# EAGLE design design 1 - fan controller (EAGLE 9.6.2)
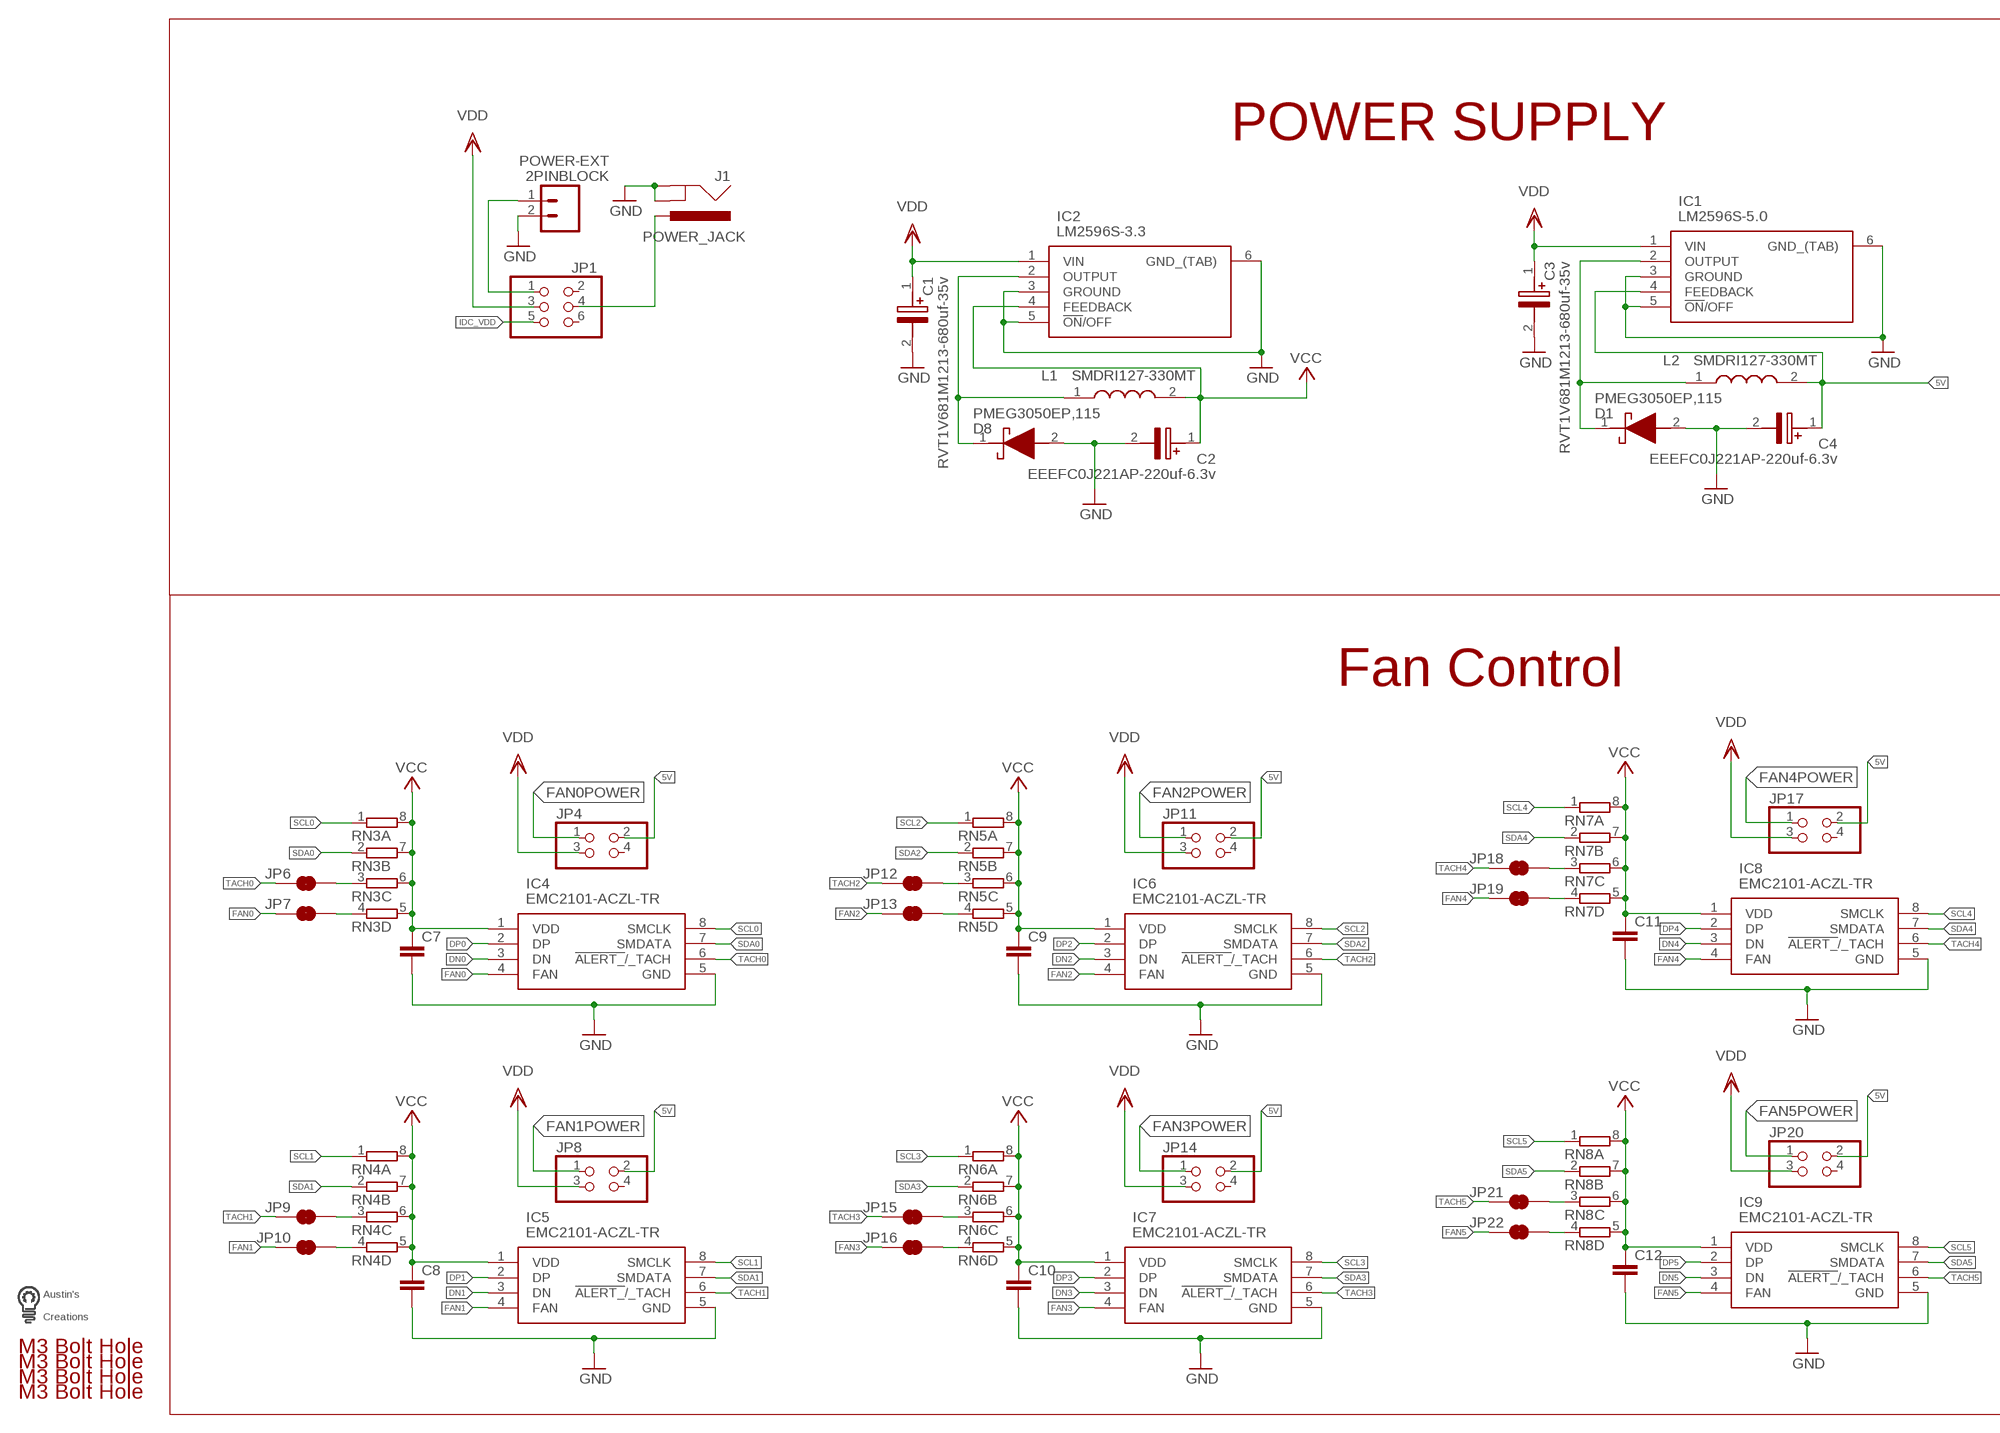
[diagram p0: schematic, sheet 1, part 1 of 2]
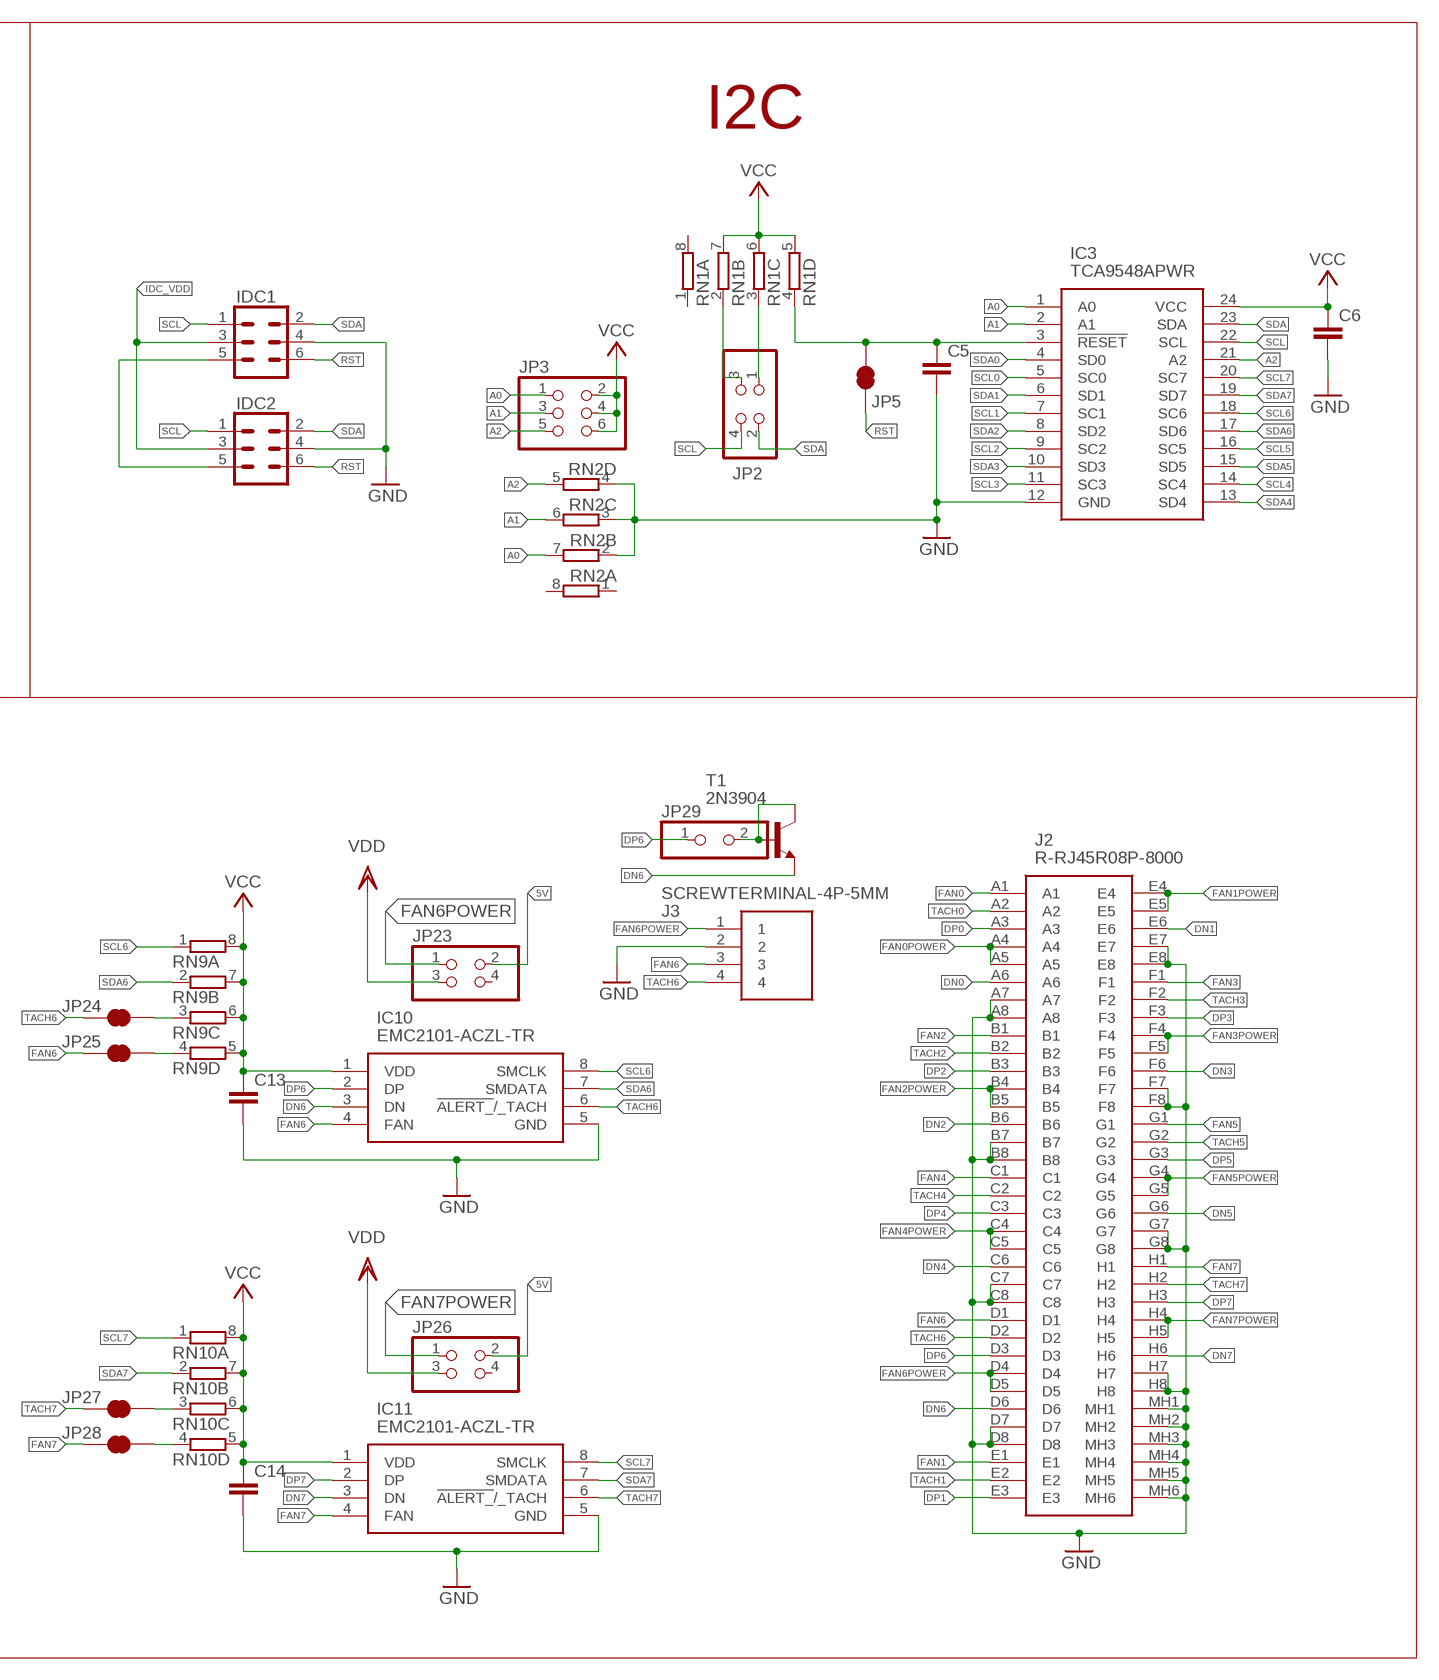
[diagram p1: schematic, sheet 1, part 2 of 2]

## Parts
C1  RVT1V681M1213-680uf-35v  EEE-HD1V681AQ  [CAPAE1350X1400N]
C2  EEEFC0J221AP-220uf-6.3v  EEEFC0J221AP  [CAPAE830X650N]
C3  RVT1V681M1213-680uf-35v  EEE-HD1V681AQ  [CAPAE1350X1400N]
C4  EEEFC0J221AP-220uf-6.3v  EEEFC0J221AP  [CAPAE830X650N]
C5  C-EUC0603  [C0603]
C6  C-EUC0603  [C0603]
C7  C-EUC0603  [C0603]
C8  C-EUC0603  [C0603]
C9  C-EUC0603  [C0603]
C10  C-EUC0603  [C0603]
C11  C-EUC0603  [C0603]
C12  C-EUC0603  [C0603]
C13  C-EUC0603  [C0603]
C14  C-EUC0603  [C0603]
D1  PMEG3050EP,115  [PMEG3050EP115]
D8  PMEG3050EP,115  [PMEG3050EP115]
IC1  LM2596S-5.0  LM2596S-3.3_NOPB  [TO170P1435X465-6N]
IC2  LM2596S-3.3  LM2596S-3.3_NOPB  [TO170P1435X465-6N]
IC3  TCA9548APWR  [SOP65P640X120-24N]
IC4  EMC2101-ACZL-TR  [SOP65P490X110-8N]
IC5  EMC2101-ACZL-TR  [SOP65P490X110-8N]
IC6  EMC2101-ACZL-TR  [SOP65P490X110-8N]
IC7  EMC2101-ACZL-TR  [SOP65P490X110-8N]
IC8  EMC2101-ACZL-TR  [SOP65P490X110-8N]
IC9  EMC2101-ACZL-TR  [SOP65P490X110-8N]
IC10  EMC2101-ACZL-TR  [SOP65P490X110-8N]
IC11  EMC2101-ACZL-TR  [SOP65P490X110-8N]
IDC1  CONN_03X2SHROUD  [2X3-SHROUDED]
IDC2  CONN_03X2SHROUD  [2X3-SHROUDED]
J1  POWER_JACK  [POWER_JACK_PTH]
J2  R-RJ45R08P-8000  [RRJ45R08P8000]
J3  SCREWTERMINAL-4P-5MM  [SCREWTERMINAL-4P-5MM]
JP1  PINHD-2X3  [2X03]
JP2  PINHD-2X2  [2X02]
JP3  PINHD-2X3  [2X03]
JP4  PINHD-2X2  [2X02]
JP5  JUMPER-SMT_2_NC_TRACE_SILK  [SMT-JUMPER_2_NC_TRACE_SILK]
JP6  JUMPER-SMT_2_NC_TRACE_SILK  [SMT-JUMPER_2_NC_TRACE_SILK]
JP7  JUMPER-SMT_2_NC_TRACE_SILK  [SMT-JUMPER_2_NC_TRACE_SILK]
JP8  PINHD-2X2  [2X02]
JP9  JUMPER-SMT_2_NC_TRACE_SILK  [SMT-JUMPER_2_NC_TRACE_SILK]
JP10  JUMPER-SMT_2_NC_TRACE_SILK  [SMT-JUMPER_2_NC_TRACE_SILK]
JP11  PINHD-2X2  [2X02]
JP12  JUMPER-SMT_2_NC_TRACE_SILK  [SMT-JUMPER_2_NC_TRACE_SILK]
JP13  JUMPER-SMT_2_NC_TRACE_SILK  [SMT-JUMPER_2_NC_TRACE_SILK]
JP14  PINHD-2X2  [2X02]
JP15  JUMPER-SMT_2_NC_TRACE_SILK  [SMT-JUMPER_2_NC_TRACE_SILK]
JP16  JUMPER-SMT_2_NC_TRACE_SILK  [SMT-JUMPER_2_NC_TRACE_SILK]
JP17  PINHD-2X2  [2X02]
JP18  JUMPER-SMT_2_NC_TRACE_SILK  [SMT-JUMPER_2_NC_TRACE_SILK]
JP19  JUMPER-SMT_2_NC_TRACE_SILK  [SMT-JUMPER_2_NC_TRACE_SILK]
JP20  PINHD-2X2  [2X02]
JP21  JUMPER-SMT_2_NC_TRACE_SILK  [SMT-JUMPER_2_NC_TRACE_SILK]
JP22  JUMPER-SMT_2_NC_TRACE_SILK  [SMT-JUMPER_2_NC_TRACE_SILK]
JP23  PINHD-2X2  [2X02]
JP24  JUMPER-SMT_2_NC_TRACE_SILK  [SMT-JUMPER_2_NC_TRACE_SILK]
JP25  JUMPER-SMT_2_NC_TRACE_SILK  [SMT-JUMPER_2_NC_TRACE_SILK]
JP26  PINHD-2X2  [2X02]
JP27  JUMPER-SMT_2_NC_TRACE_SILK  [SMT-JUMPER_2_NC_TRACE_SILK]
JP28  JUMPER-SMT_2_NC_TRACE_SILK  [SMT-JUMPER_2_NC_TRACE_SILK]
JP29  PINHD-1X2  [1X02]
L1  SMDRI127-330MT  CDRH127_LDNP-330MC  [INDPM120120X800N]
L2  SMDRI127-330MT  CDRH127_LDNP-330MC  [INDPM120120X800N]
POWER-EXT  2PINBLOCK  [SCREWTERMINAL-5MM-2]
RN1  4R-N0603-ARC  [0603-ARC]
RN2  4R-N0603-ARC  [0603-ARC]
RN3  4R-N0603-ARC  [0603-ARC]
RN4  4R-N0603-ARC  [0603-ARC]
RN5  4R-N0603-ARC  [0603-ARC]
RN6  4R-N0603-ARC  [0603-ARC]
RN7  4R-N0603-ARC  [0603-ARC]
RN8  4R-N0603-ARC  [0603-ARC]
RN9  4R-N0603-ARC  [0603-ARC]
RN10  4R-N0603-ARC  [0603-ARC]
T1  2N3904  [TO92]
U$1  M3BOLTHOLE  [M3BOLTHOLE]
U$2  M3BOLTHOLE  [M3BOLTHOLE]
U$3  M3BOLTHOLE  [M3BOLTHOLE]
U$4  M3BOLTHOLE  [M3BOLTHOLE]
U$5  LOGOMED  [LOGOMED]

## Nets
5V: C4.1(+) IC1.4(FEEDBACK) JP4.2 JP8.2 JP11.2 JP14.2 JP17.2 JP20.2 JP23.2 JP26.2 L2.2
$2: JP29.2 T1.1(C) T1.2(B)
A0: IC3.1(A0) JP3.1 RN2.7
A1: IC3.2(A1) JP3.3 RN2.6
A2: IC3.21(A2) JP3.5 RN2.5
DN0: IC4.3(DN) J2.A6
DN1: IC5.3(DN) J2.E6
DN2: IC6.3(DN) J2.B6
DN3: IC7.3(DN) J2.F6
DN4: IC8.3(DN) J2.C6
DN5: IC9.3(DN) J2.G6
DN6: IC10.3(DN) J2.D6 T1.3(E)
DN7: IC11.3(DN) J2.H6
DP0: IC4.2(DP) J2.A3
DP1: IC5.2(DP) J2.E3
DP2: IC6.2(DP) J2.B3
DP3: IC7.2(DP) J2.F3
DP4: IC8.2(DP) J2.C3
DP5: IC9.2(DP) J2.G3
DP6: IC10.2(DP) J2.D3 JP29.1
DP7: IC11.2(DP) J2.H3
FAN0: IC4.4(FAN) J2.A1 JP7.1
FAN0POWER: J2.A4 J2.A5 JP4.1
FAN1: IC5.4(FAN) J2.E1 JP10.1
FAN1POWER: J2.E4 J2.E5 JP8.1
FAN2: IC6.4(FAN) J2.B1 JP13.1
FAN2POWER: J2.B4 J2.B5 JP11.1
FAN3: IC7.4(FAN) J2.F1 JP16.1
FAN3POWER: J2.F4 J2.F5 JP14.1
FAN4: IC8.4(FAN) J2.C1 JP19.1
FAN4POWER: J2.C4 J2.C5 JP17.1
FAN5: IC9.4(FAN) J2.G1 JP22.1
FAN5POWER: J2.G4 J2.G5 JP20.1
FAN6: IC10.4(FAN) J2.D1 J3.3 JP25.1
FAN6POWER: J2.D4 J2.D5 J3.1 JP23.1
FAN7: IC11.4(FAN) J2.H1 JP28.1
FAN7POWER: J2.H4 J2.H5 JP26.1
GND: C1.2(-) C2.2(-) C3.2(-) C4.2(-) C5.2 C6.2 C7.2 C8.2 C9.2 C10.2 C11.2 C12.2 C13.2 C14.2 D1.2(A) D8.2(A) IC1.3(GROUND) IC1.5(!ON!/OFF) IC1.6(GND_(TAB)) IC2.3(GROUND) IC2.5(!ON!/OFF) IC2.6(GND_(TAB)) IC3.12(GND) IC4.5(GND) IC5.5(GND) IC6.5(GND) IC7.5(GND) IC8.5(GND) IC9.5(GND) IC10.5(GND) IC11.5(GND) IDC1.4 IDC2.4 J1.GND J1.GNDBREAK J2.A7 J2.A8 J2.B7 J2.B8 J2.C7 J2.C8 J2.D7 J2.D8 J2.E7 J2.E8 J2.F7 J2.F8 J2.G7 J2.G8 J2.H7 J2.H8 J2.MH1 J2.MH2 J2.MH3 J2.MH4 J2.MH5 J2.MH6 J3.2 POWER-EXT.2 RN2.2 RN2.3 RN2.4
IDC_VDD: IDC1.3 IDC2.3 JP1.5
N$1: D1.1(K) IC1.2(OUTPUT) L2.1
N$2: C5.1 IC3.3(!RESET) JP5.2 RN1.4
N$3: JP6.2 RN3.3
N$4: JP1.1 POWER-EXT.1
N$5: JP7.2 RN3.4
N$6: J1.PWR JP1.4
N$7: JP9.2 RN4.3
N$8: JP10.2 RN4.4
N$9: JP12.2 RN5.3
N$10: JP13.2 RN5.4
N$11: JP15.2 RN6.3
N$12: IDC1.5 IDC2.5
N$13: JP16.2 RN6.4
N$14: JP18.2 RN7.3
N$15: JP19.2 RN7.4
N$16: JP21.2 RN8.3
N$17: JP22.2 RN8.4
N$18: JP24.2 RN9.3
N$19: JP25.2 RN9.4
N$20: D8.1(K) IC2.2(OUTPUT) L1.1
N$21: JP27.2 RN10.3
N$22: JP28.2 RN10.4
N$25: JP2.3 RN1.2
N$26: JP2.1 RN1.3
RST: IDC1.6 IDC2.6 JP5.1
SCL: IC3.22(SCL) IDC1.1 IDC2.1 JP2.4
SCL0: IC3.5(SC0) IC4.8(SMCLK) RN3.1
SCL1: IC3.7(SC1) IC5.8(SMCLK) RN4.1
SCL2: IC3.9(SC2) IC6.8(SMCLK) RN5.1
SCL3: IC3.11(SC3) IC7.8(SMCLK) RN6.1
SCL4: IC3.14(SC4) IC8.8(SMCLK) RN7.1
SCL5: IC3.16(SC5) IC9.8(SMCLK) RN8.1
SCL6: IC3.18(SC6) IC10.8(SMCLK) RN9.1
SCL7: IC3.20(SC7) IC11.8(SMCLK) RN10.1
SDA: IC3.23(SDA) IDC1.2 IDC2.2 JP2.2
SDA0: IC3.4(SD0) IC4.7(SMDATA) RN3.2
SDA1: IC3.6(SD1) IC5.7(SMDATA) RN4.2
SDA2: IC3.8(SD2) IC6.7(SMDATA) RN5.2
SDA3: IC3.10(SD3) IC7.7(SMDATA) RN6.2
SDA4: IC3.13(SD4) IC8.7(SMDATA) RN7.2
SDA5: IC3.15(SD5) IC9.7(SMDATA) RN8.2
SDA6: IC3.17(SD6) IC10.7(SMDATA) RN9.2
SDA7: IC3.19(SD7) IC11.7(SMDATA) RN10.2
TACH0: IC4.6(!ALERT_!/_TACH) J2.A2 JP6.1
TACH1: IC5.6(!ALERT_!/_TACH) J2.E2 JP9.1
TACH2: IC6.6(!ALERT_!/_TACH) J2.B2 JP12.1
TACH3: IC7.6(!ALERT_!/_TACH) J2.F2 JP15.1
TACH4: IC8.6(!ALERT_!/_TACH) J2.C2 JP18.1
TACH5: IC9.6(!ALERT_!/_TACH) J2.G2 JP21.1
TACH6: IC10.6(!ALERT_!/_TACH) J2.D2 J3.4 JP24.1
TACH7: IC11.6(!ALERT_!/_TACH) J2.H2 JP27.1
VCC: C2.1(+) C6.1 C7.1 C8.1 C9.1 C10.1 C11.1 C12.1 C13.1 C14.1 IC2.4(FEEDBACK) IC3.24(VCC) IC4.1(VDD) IC5.1(VDD) IC6.1(VDD) IC7.1(VDD) IC8.1(VDD) IC9.1(VDD) IC10.1(VDD) IC11.1(VDD) JP3.2 JP3.4 JP3.6 L1.2 RN1.5 RN1.6 RN1.7 RN3.5 RN3.6 RN3.7 RN3.8 RN4.5 RN4.6 RN4.7 RN4.8 RN5.5 RN5.6 RN5.7 RN5.8 RN6.5 RN6.6 RN6.7 RN6.8 RN7.5 RN7.6 RN7.7 RN7.8 RN8.5 RN8.6 RN8.7 RN8.8 RN9.5 RN9.6 RN9.7 RN9.8 RN10.5 RN10.6 RN10.7 RN10.8
VDD: C1.1(+) C3.1(+) IC1.1(VIN) IC2.1(VIN) JP1.3 JP4.3 JP8.3 JP11.3 JP14.3 JP17.3 JP20.3 JP23.3 JP26.3
Unconnected: JP1.2 JP1.6 JP4.4 JP8.4 JP11.4 JP14.4 JP17.4 JP20.4 JP23.4 JP26.4 RN1.1 RN1.8 RN2.1 RN2.8

## Notes on the sheet
- I2C
- POWER SUPPLY
- Fan Control

## Library data of the parts
C1 C3 = SamacSys_Parts:EEE-HD1V681AQ: Aluminium Electrolytic Capacitors - SMD 35VDC 680uF 20% AEC-Q200 Source: Datasheet <https://industrial.panasonic.com/cdbs/www-data/pdf/RDE0000/ABA0000C1166.pdf>; DESCRIPTION: Aluminium Electrolytic Capacitors - SMD 35VDC 680uF 20% AEC-Q200; HEIGHT: 14mm; MANUFACTURER_NAME: Panasonic; MANUFACTURER_PART_NUMBER: EEE-HD1V681AQ; MOUSER_PART_NUMBER: 667-EEE-HD1V681AQ; MOUSER_PRICE-STOCK: https://www.mouser.co.uk/ProductDetail/Panasonic/EEE-HD1V681AQ?qs=w%2Fv1CP2dgqoW7i2Hoqi%252B9w%3D%3D
C2 C4 = SamacSys_Parts:EEEFC0J221AP: PANASONIC - EEEFC0J221AP - SMD Aluminium Electrolytic Capacitor, Radial Can - SMD, 220 F, 6.3 V, EEEFC Series Source: Datasheet <https://industrial.panasonic.com/cdbs/www-data/pdf/RDE0000/ABA0000C1169.pdf>; DESCRIPTION: PANASONIC - EEEFC0J221AP - SMD Aluminium Electrolytic Capacitor, Radial Can - SMD, 220 F, 6.3 V, EEEFC Series; HEIGHT: 6.5mm; MANUFACTURER_NAME: Panasonic; MANUFACTURER_PART_NUMBER: EEEFC0J221AP
C5-C14 = rcl:C-EU: CAPACITOR, European symbol; SPICEPREFIX: C
D1 D8 = SamacSys_Parts:PMEG3050EP,115: NXP PMEG3050EP,115 SMT Schottky Diode, 30V 5A, 2-Pin SOD-128 Source: Datasheet <https://docs-emea.rs-online.com/webdocs/14cd/0900766b814cd012.pdf>; ARROW_PART_NUMBER: PMEG3050EP,115; ARROW_PRICE-STOCK: https://www.arrow.com/en/products/pmeg3050ep115/nexperia; DESCRIPTION: NXP PMEG3050EP,115 SMT Schottky Diode, 30V 5A, 2-Pin SOD-128; HEIGHT: 1mm; MANUFACTURER_NAME: Nexperia; MANUFACTURER_PART_NUMBER: PMEG3050EP,115; MOUSER_PART_NUMBER: 771-PMEG3050EP115; MOUSER_PRICE-STOCK: https://www.mouser.co.uk/ProductDetail/Nexperia/PMEG3050EP115?qs=GcY6OjH1zdmnjQ%2FhUT5aOA%3D%3D
IC1 IC2 = SamacSys_Parts:LM2596S-3.3_NOPB: SIMPLE SWITCHER® 4.5V to 40V, 3A Low Component Count Step-Down Regulator Source: Datasheet <http://www.ti.com/lit/ds/symlink/lm2596.pdf>; DESCRIPTION: SIMPLE SWITCHER&#174; 4.5V to 40V, 3A Low Component Count Step-Down Regulator; HEIGHT: 4.65mm; MANUFACTURER_NAME: Texas Instruments; MANUFACTURER_PART_NUMBER: LM2596S-3.3/NOPB; MOUSER_PART_NUMBER: 926-LM2596S-3.3/NOPB; MOUSER_PRICE-STOCK: https://www.mouser.co.uk/ProductDetail/Texas-Instruments/LM2596S-33-NOPB?qs=X1J7HmVL2ZHsEwG9Q6doow%3D%3D
IC3 = custom parts:TCA9548APWR: TEXAS INSTRUMENTS - TCA9548APWR - I2C SWITCH W/ RESET, 8-CH, TSSOP-24 Source: Datasheet <http://www.ti.com/lit/ds/symlink/tca9548a.pdf>; DESCRIPTION: TEXAS INSTRUMENTS - TCA9548APWR - I2C SWITCH W/ RESET, 8-CH, TSSOP-24; HEIGHT: 1.2mm; MANUFACTURER_NAME: Texas Instruments; MANUFACTURER_PART_NUMBER: TCA9548APWR; MOUSER_PART_NUMBER: 595-TCA9548APWR; MOUSER_PRICE-STOCK: https://www.mouser.co.uk/ProductDetail/Texas-Instruments/TCA9548APWR?qs=iFaFN7AS2WF%252BqSiJMbdYwQ%3D%3D
IC4-IC11 = custom parts:EMC2101-ACZL-TR: MICROCHIP - EMC2101-ACZL-TR - SINGLE FAN CONTROLLER WITH INTERNAL AND EXTERNAL SENSOR, I2C/SMBUS 8 MSOP 3X3MM T/R Source: Datasheet <http://ww1.microchip.com/downloads/en/DeviceDoc/2101.pdf>; DESCRIPTION: MICROCHIP - EMC2101-ACZL-TR - SINGLE FAN CONTROLLER WITH INTERNAL AND EXTERNAL SENSOR, I2C/SMBUS 8 MSOP 3X3MM T/R; HEIGHT: 1.1mm; MANUFACTURER_NAME: Microchip; MANUFACTURER_PART_NUMBER: EMC2101-ACZL-TR; MOUSER_PART_NUMBER: 886-EMC2101-ACZL-TR; MOUSER_PRICE-STOCK: https://www.mouser.co.uk/ProductDetail/Microchip-Technology/EMC2101-ACZL-TR?qs=pA5MXup5wxFIE%2FN8LSbs9g%3D%3D
IDC1 IDC2 = custom parts:CONN_03X2: Multi connection point. Often used as Generic Header-pin footprint for 0.1 inch spaced/style header connections You can populate with any combo of single row headers, but if you'd like an exact match, check these: Header - 2x3 (Male, 0.1") <https://www.sparkfun.com/products/12807> (PRT-12807) Header - 2x3 (Female, 0.1") <https://www.sparkfun.com/products/13010> (PRT-13010) 2x3 Pin Shrouded Header <https://www.sparkfun.com/products/10877> (PRT-10877) On any of the 0.1 inch spaced packages, you can populate with these: Break Away Headers - Straight <https://www.sparkfun.com/products/116> (PRT-00116) Break Away Male Headers - Right Angle <https://www.sparkfun.com/products/553> (PRT-00553) Female Headers <https://www.sparkfun.com/products/115> (PRT-00115) Break Away Headers - Machine Pin <https://www.sparkfun.com/products/117> (PRT-00117) Break Away Female Headers - Swiss Machine Pin <https://www.sparkfun.com/products/743> (PRT-00743) Special note: the shrouded connector mates well with our 3x2 ribbon cables: Ribbon Crimp Connector - 6-pin (2x3, Female) <https://www.sparkfun.com/products/10651> (PRT-10651) Ribbon Cable - 6 wire (15ft) <https://www.sparkfun.com/products/10646> (PRT-10646); PROD_ID: CONN-10681; SF_ID: PRT_10877
J1 = custom parts:POWER_JACK: Power Jack Connector This is the standard 5.5mm barrel jack for power. The PTH is the most common, proven, reliable, footprint. The Slot footprint only works if the mill layer is transmitted to the PCB fab house so be warned. Here are the connectors we sell at SparkFun: DC Barrel Power Jack/Connector <https://www.sparkfun.com/products/119> (PRT-00119) DC Barrel Power Jack/Connector (SMD) <https://www.sparkfun.com/products/12748> (PRT-12748) DC Barrel Jack Adapter - Breadboard Compatible <https://www.sparkfun.com/products/10811> (PRT-10811) It is used on this SparkFun product (and many, many others): SparkFun RedBoard - Programmed with Arduino <https://www.sparkfun.com/products/12757> (DEV-12757) Also, if you need a mating power supply or connector, please check these out: Wall Adapter Power Supply - 9VDC 650mA <https://www.sparkfun.com/products/298> (TOL-00298) DC Barrel Jack Adapter - Male <https://www.sparkfun.com/products/10287> (PRT-10287); PROD_ID: CONN-08197
J2 = custom parts:R-RJ45R08P-8000: Ethernet Connectors/Modular Connectors (RJ45 RJ11) Through Hole RoHS Source: Datasheet <https://datasheet.lcsc.com/szlcsc/1905231215_Shenzhen-Cankemeng-R-RJ45R08P-8000_C386760.pdf>; DESCRIPTION: Ethernet Connectors/Modular Connectors (RJ45 RJ11) Through Hole RoHS; HEIGHT: 25.55mm; MANUFACTURER_NAME: Shenzhen Cankemeng; MANUFACTURER_PART_NUMBER: R-RJ45R08P-8000
J3 = SamacSys_Parts:SCREWTERMINAL-4P-5MM: Fixed Terminal Blocks Terminal block, screw type, 5.00, horizontal, 4 poles, CUI Blue, slotted screw, PCB mount Source: Datasheet <https://componentsearchengine.com/Datasheets/1/TB001-500-04BE.pdf>; DESCRIPTION: Fixed Terminal Blocks Terminal block, screw type, 5.00, horizontal, 4 poles, CUI Blue, slotted screw, PCB mount; HEIGHT: 12.9mm; MANUFACTURER_NAME: CUI Inc.; MANUFACTURER_PART_NUMBER: TB001-500-04BE; MOUSER_PART_NUMBER: 490-TB001-500-04BE; MOUSER_PRICE-STOCK: https://www.mouser.co.uk/ProductDetail/CUI-Devices/TB001-500-04BE?qs=vLWxofP3U2xFd1xqNcHXZA%3D%3D
JP1 JP3 = pinhead:PINHD-2X3: PIN HEADER
JP2 JP4 JP8 JP11 JP14 JP17 JP20 JP23 JP26 = pinhead:PINHD-2X2: PIN HEADER
JP5-JP7 JP9 JP10 JP12 JP13 JP15 JP16 JP18 JP19 JP21 JP22 JP24 JP25 JP27 JP28 = SparkFun-Jumpers:JUMPER-SMT_2_NC_TRACE: Normally closed trace jumper This jumper has a trace between two pads so it's normally closed (NC). Use a razor knife to open the connection. For best results follow the IPC guidelines for cutting traces: Cutout at least 0.063 mm (0.005 in). Remove all loose material to clean up the cut area. Seal the cut with an approved epoxy. Reapply solder to reclose the connection.
JP29 = custom parts:PINHD-1X2: PIN HEADER
L1 L2 = SamacSys_Parts:CDRH127_LDNP-330MC: Fixed Inductors 33uH 3.9A Source: Datasheet <https://products.sumida.com/products/pdf/CDRH127LD.pdf>; DESCRIPTION: Fixed Inductors 33uH 3.9A; HEIGHT: 8mm; MANUFACTURER_NAME: Sumida; MANUFACTURER_PART_NUMBER: CDRH127/LDNP-330MC; MOUSER_PART_NUMBER: 851-CDRH127LDNP330MC; MOUSER_PRICE-STOCK: https://www.mouser.co.uk/ProductDetail/Sumida/CDRH127-LDNP-330MC?qs=rZntyWl5IYHj3wgmnQ0WOg%3D%3D
POWER-EXT = custom parts:2PINBLOCK
RN1-RN10 = custom parts:4R-N: Array Chip Resistor Source: RS Component / Phycomp; OC_FARNELL: unknown; OC_NEWARK: unknown
T1 = transistor-neu-to92:2N3904: NPN TRANSISTOR
U$1-U$4 = custom parts:M3BOLTHOLE
U$5 = custom parts:LOGOMED

## Board
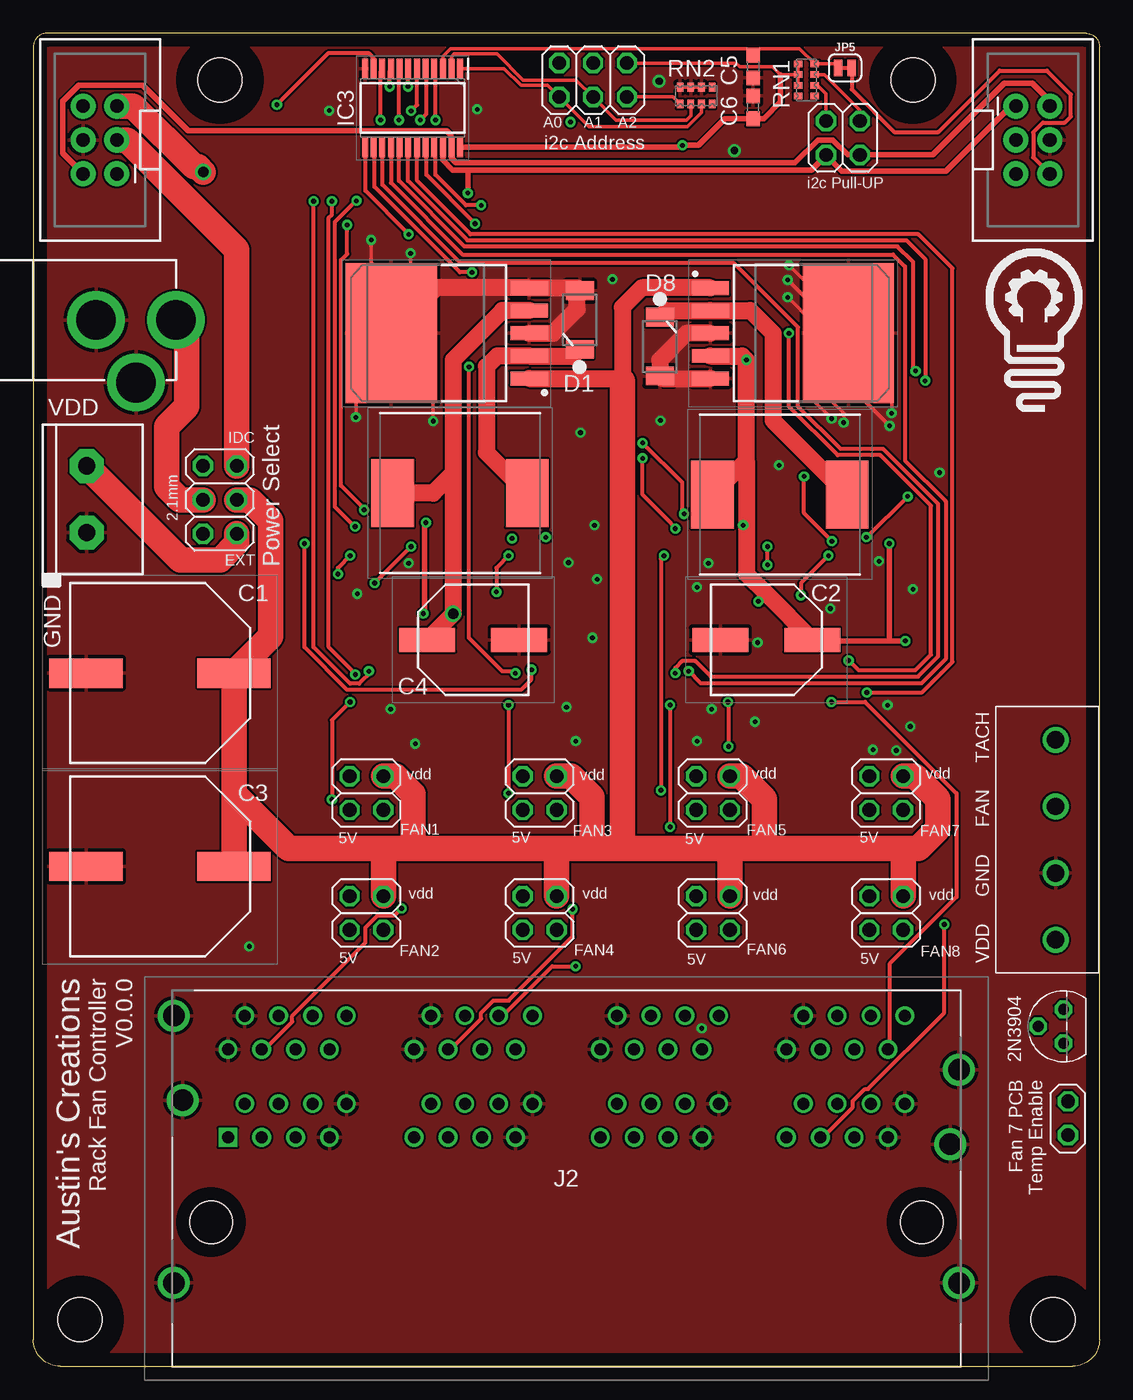
[diagram p2: board, top side]
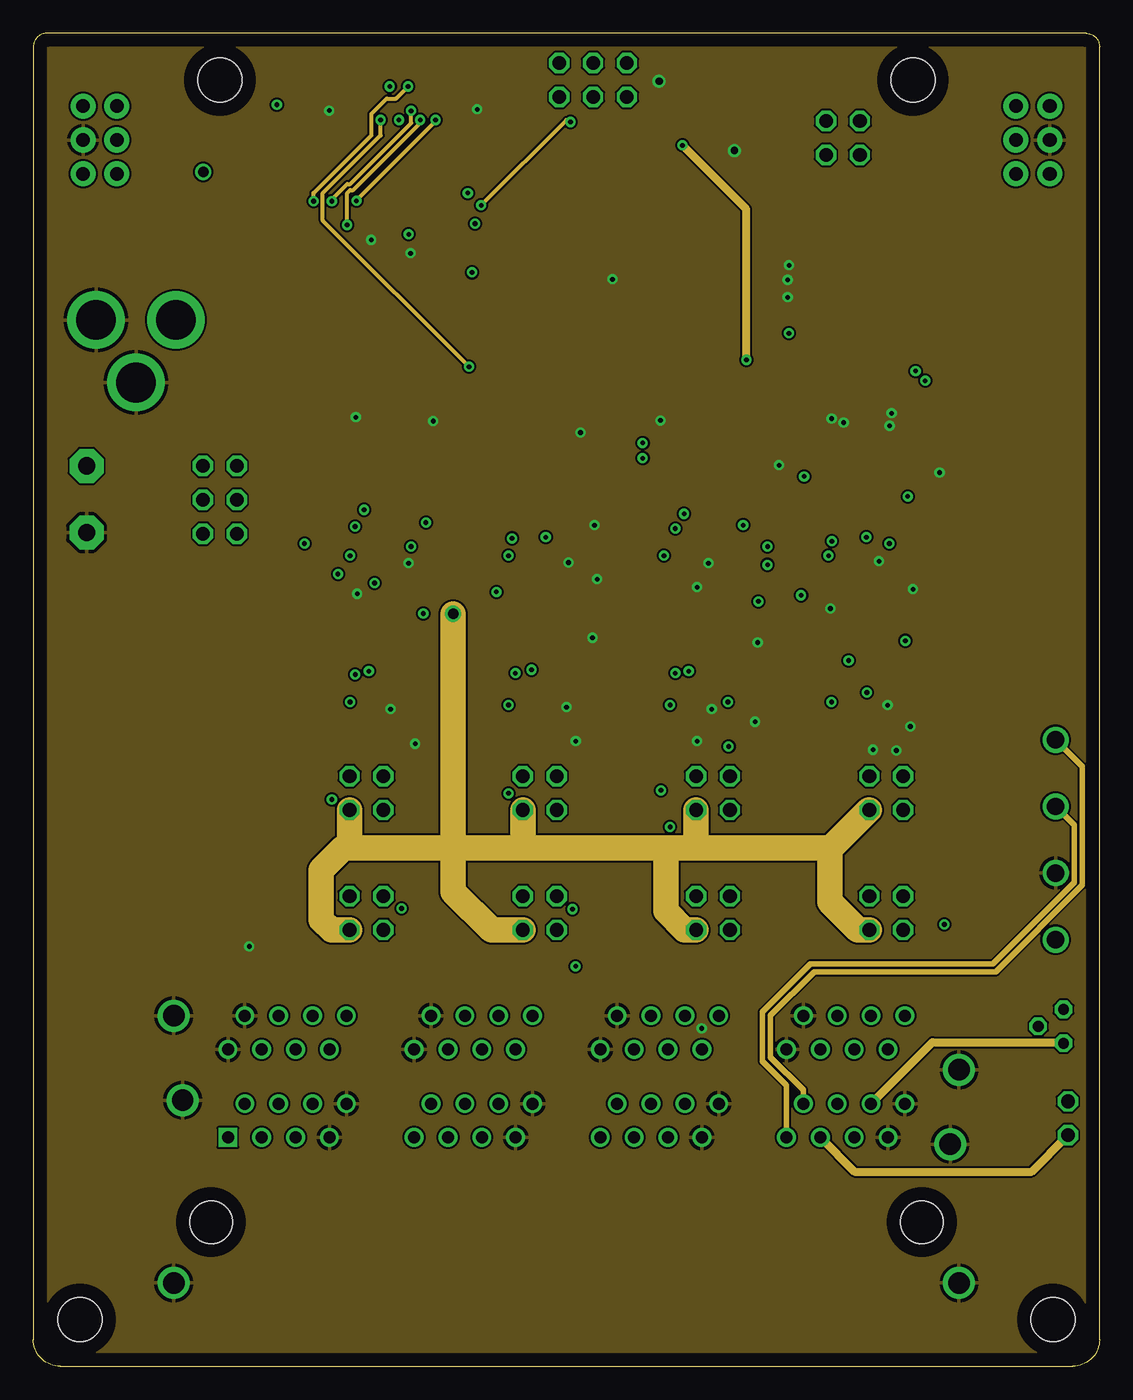
[diagram p3: board, inner layer Route2]
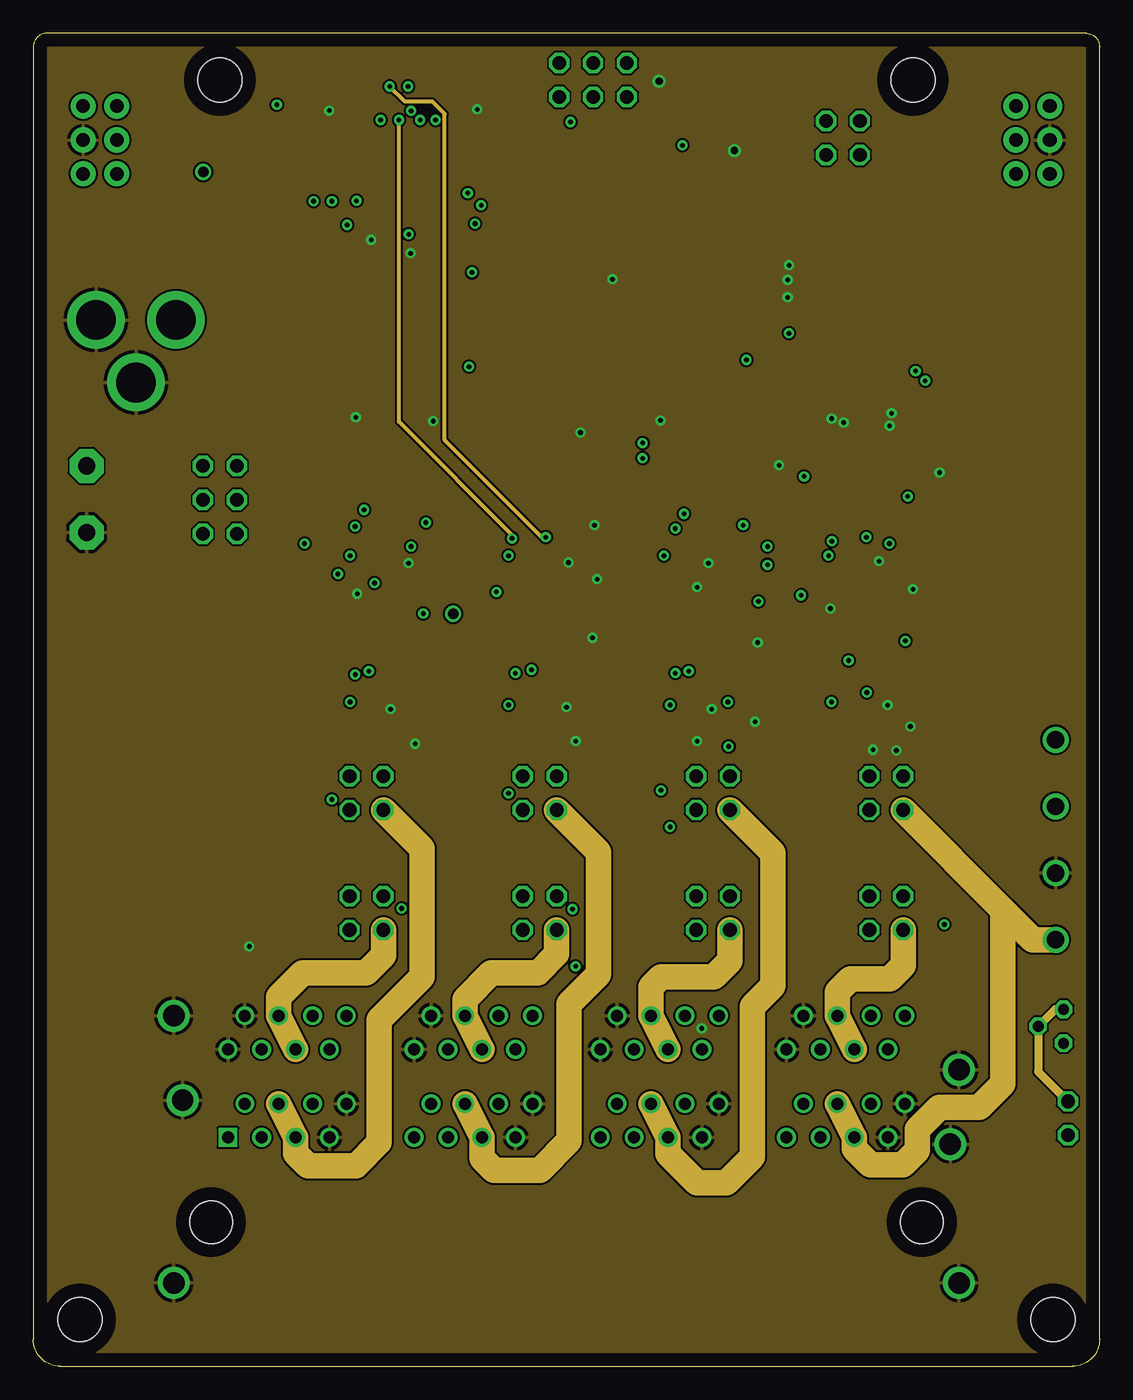
[diagram p4: board, inner layer Route15]
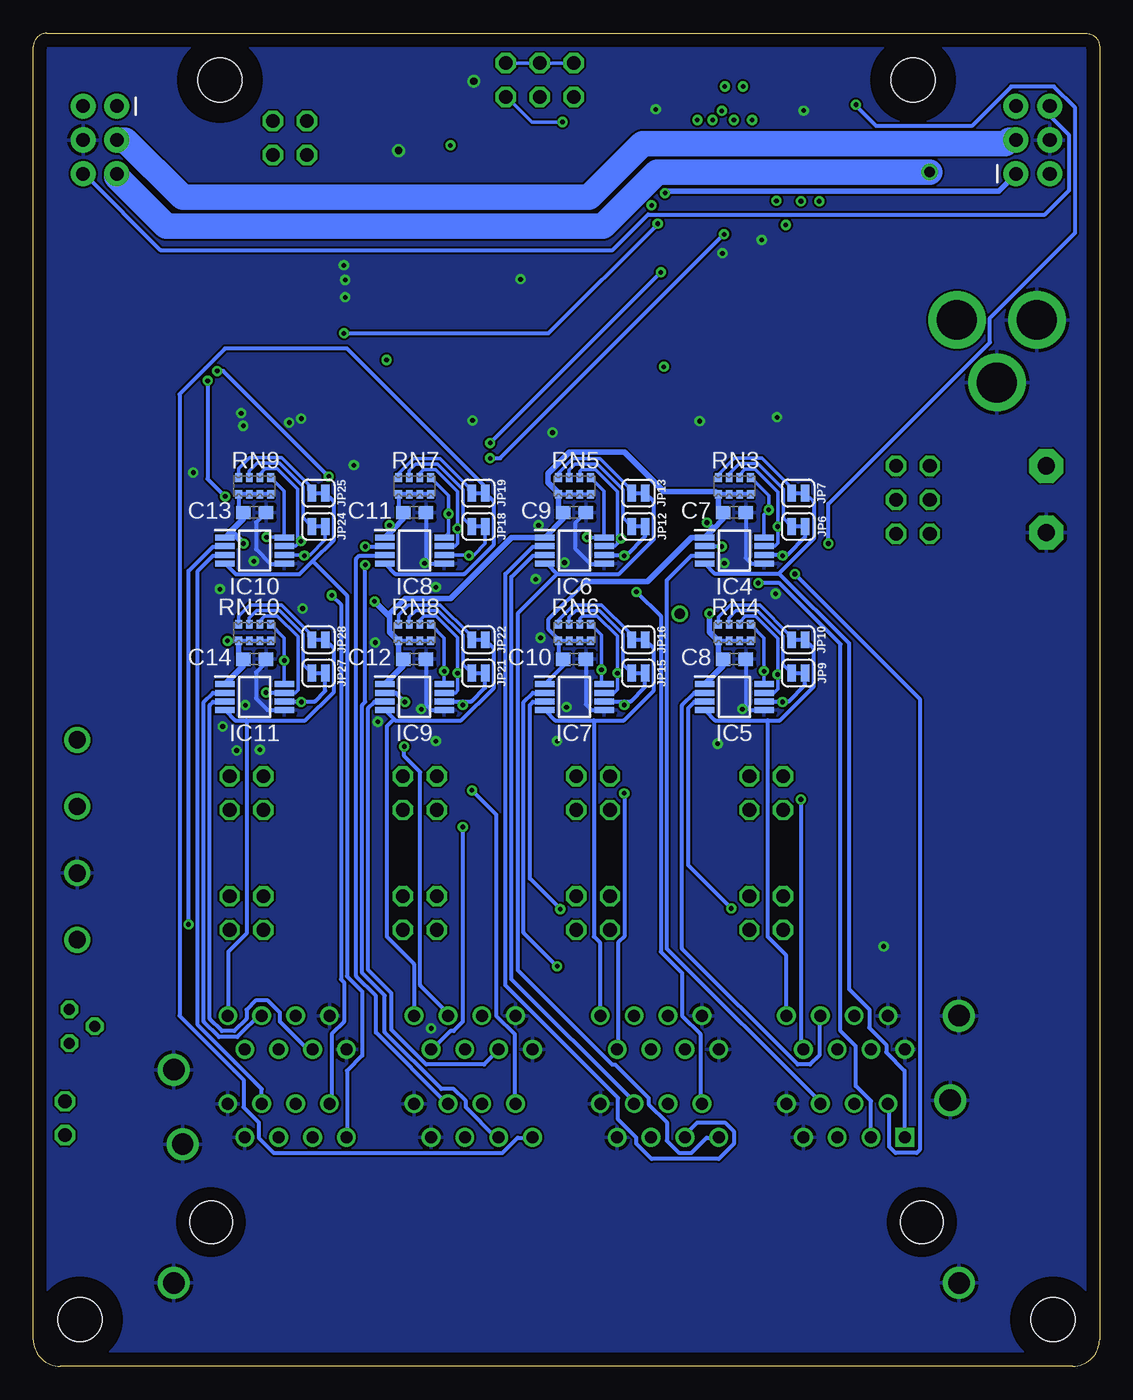
[diagram p5: board, bottom side, seen from below]

Size 80 x 100 mm. Coordinates in mm from the lower left corner, seen from the top.
Outline: 2,0 78,0 arc90 80,2 80,99 arc90 79,100 1,100 arc90 0,99 0,2 arc90 2,0
Copper layers (1+2*15+16): Top 0.035mm / dielectric 0.48mm / Route2 0.035mm / dielectric 0.5mm / Route15 0.035mm / dielectric 0.48mm / Bottom 0.035mm
Design rules "default *": minimum track width 10mil, minimum drill 0.35mm, track to track 6mil, track to pad 6mil, pad to pad 6mil, via to via 6mil, smd to smd 6mil, copper to edge 40mil, drill to drill 6mil, minimum pad ring 10mil, minimum via ring 8mil, stop-mask expansion 4mil, vias tented up to drill 0.5mm, thermal gap 10mil
tRestrict: area 10.8,93.3 to 17.2,99.7; area 62.8,93.3 to 69.2,99.7; area 73.3,0.3 to 79.7,6.7; area 0.3,0.3 to 6.7,6.7
bRestrict: area 10.8,93.3 to 17.2,99.7; area 62.8,93.3 to 69.2,99.7; area 73.3,0.3 to 79.7,6.7; area 0.3,0.3 to 6.7,6.7

### Footprints (pad centres in the part's own frame; a part is rotated, then mirrored left to right if it is on the bottom)
CAPAE1350X1400N = smd 5.5 x 2.2: 1 -5.55,0; 2 5.55,0
CAPAE830X650N = smd 4.2 x 1.8: 1 -3.45,0; 2 3.45,0
C0603 = smd 1.1 x 1: 1 -0.85,0; 2 0.85,0
PMEG3050EP115 = smd 1.4 x 2.1: 1 -2.2,0; 2 2.2,0
TO170P1435X465-6N = smd 2.8 x 1.05: 1 -6.2,3.4; 2 -6.2,1.7; 3 -6.2,0; 4 -6.2,-1.7; 5 -6.2,-3.4 | smd 6.85 x 10.5: 6 4.15,0
SOP65P640X120-24N = smd 1.475 x 0.45: 1 -2.938,3.575; 2 -2.938,2.925; 3 -2.938,2.275; 4 -2.938,1.625; 5 -2.938,0.975; 6 -2.938,0.325; 7 -2.938,-0.325; 8 -2.938,-0.975; 9 -2.938,-1.625; 10 -2.938,-2.275; 11 -2.938,-2.925; 12 -2.938,-3.575; 13 2.938,-3.575; 14 2.938,-2.925; 15 2.938,-2.275; 16 2.938,-1.625; 17 2.938,-0.975; 18 2.938,-0.325; 19 2.938,0.325; 20 2.938,0.975; 21 2.938,1.625; 22 2.938,2.275; 23 2.938,2.925; 24 2.938,3.575
SOP65P490X110-8N = smd 1.45 x 0.45: 1 -2.225,0.975; 2 -2.225,0.325; 3 -2.225,-0.325; 4 -2.225,-0.975; 5 2.225,-0.975; 6 2.225,-0.325; 7 2.225,0.325; 8 2.225,0.975
2X3-SHROUDED = drill 1.016 pad 1.88: 1 -1.27,2.54; 2 1.27,2.54; 3 -1.27,0; 4 1.27,0; 5 -1.27,-2.54; 6 1.27,-2.54
POWER_JACK_PTH = drill 2.997 pad 4.318: GND 0,7.7; GNDBREAK 4.7,10.7; PWR 0,13.7
RRJ45R08P8000 = drill 0.9 pad 1.4 square: A1 25.4,-10.16 | drill 0.9 pad 1.4: A2 24.13,-12.7; A3 22.86,-10.16; A4 21.59,-12.7; A5 20.32,-10.16; A6 19.05,-12.7; A7 17.78,-10.16; A8 16.51,-12.7; B1 11.43,-10.16; B2 10.16,-12.7; B3 8.89,-10.16; B4 7.62,-12.7; B5 6.35,-10.16; B6 5.08,-12.7; B7 3.81,-10.16; B8 2.54,-12.7; C1 -2.54,-10.16; C2 -3.81,-12.7; C3 -5.08,-10.16; C4 -6.35,-12.7; C5 -7.62,-10.16; C6 -8.89,-12.7; C7 -10.16,-10.16; C8 -11.43,-12.7; D1 -16.51,-10.16; D2 -17.78,-12.7; D3 -19.05,-10.16; D4 -20.32,-12.7; D5 -21.59,-10.16; D6 -22.86,-12.7; D7 -24.13,-10.16; D8 -25.4,-12.7; E1 16.51,-19.3; E2 17.78,-16.76; E3 19.05,-19.3; E4 20.32,-16.76; E5 21.59,-19.3; E6 22.86,-16.76; E7 24.13,-19.3; E8 25.4,-16.76; F1 2.54,-19.3; F2 3.81,-16.76; F3 5.08,-19.3; F4 6.35,-16.76; F5 7.62,-19.3; F6 8.89,-16.76; F7 10.16,-19.3; F8 11.43,-16.76; G1 -11.43,-19.3; G2 -10.16,-16.76; G3 -8.89,-19.3; G4 -7.62,-16.76; G5 -6.35,-19.3; G6 -5.08,-16.76; G7 -3.81,-19.3; G8 -2.54,-16.76; H1 -25.4,-19.3; H2 -24.13,-16.76; H3 -22.86,-19.3; H4 -21.59,-16.76; H5 -20.32,-19.3; H6 -19.05,-16.76; H7 -17.78,-19.3; H8 -16.51,-16.76 | drill 1.6 pad 2.4: MH1 28.795,-12.96; MH2 29.46,-19.3; MH3 -29.46,-15.24; MH4 -28.795,-9.66; MH5 -29.46,0.76; MH6 29.46,0.76 | hole 3.2: 26.67,-3.81; -26.67,-3.81
SCREWTERMINAL-4P-5MM = drill 1.3 pad 1.95: 1 0,0; 2 5,0; 3 10,0; 4 15,0
2X03 = drill 1.016 octagon: 1 -2.54,-1.27; 2 -2.54,1.27; 3 0,-1.27; 4 0,1.27; 5 2.54,-1.27; 6 2.54,1.27
2X02 = drill 1.016 octagon: 1 -1.27,-1.27; 2 -1.27,1.27; 3 1.27,-1.27; 4 1.27,1.27
SMT-JUMPER_2_NC_TRACE_SILK = smd 0.635 x 1.27: 1 -0.508,0; 2 0.508,0
1X02 = drill 1.016 octagon: 1 -1.27,-1.27; 2 -1.27,1.27
INDPM120120X800N = smd 3.2 x 5.1: 1 -5.05,0; 2 5.05,0
SCREWTERMINAL-5MM-2 = drill 1.3 pad 2.54 octagon: 1 -2.54,0; 2 2.46,0
0603-ARC = smd 0.5 x 0.65: 1 -1.2,-0.625; 2 -0.4,-0.625; 3 0.4,-0.625; 4 1.2,-0.625; 5 1.2,0.625; 6 0.4,0.625; 7 -0.4,0.625; 8 -1.2,0.625
TO92 = drill 0.813 octagon: 1 1.27,0; 2 0,1.905; 3 -1.27,0
M3BOLTHOLE = hole 3.3: 0,0

### Placement (x,y rotation side)
C1  9.5,52 180 top
C2  55,54.5 180 top
C3  9.5,37.5 180 top
C4  33,54.5 0 top
C5  54,97.5 270 top
C6  54,94.45 90 top
C7  27.4,64.05 0 bottom
C8  27.4,53.05 0 bottom
C9  39.4,64.05 0 bottom
C10  39.4,53.05 0 bottom
C11  51.4,64.05 0 bottom
C12  51.4,53.05 0 bottom
C13  63.4,64.05 0 bottom
C14  63.4,53.05 0 bottom
D1  41,78.5 90 top
D8  47,76.5 270 top
IC1  31,77.5 180 top
IC2  57,77.5 0 top
IC3  28.45,94.4 270 top
IC4  27.4,61.2 0 bottom
IC5  27.4,50.2 0 bottom
IC6  39.4,61.2 0 bottom
IC7  39.4,50.2 0 bottom
IC8  51.4,61.2 0 bottom
IC9  51.4,50.2 0 bottom
IC10  63.4,61.2 0 bottom
IC11  63.4,50.2 0 bottom
IDC1  5,92 180 top
IDC2  75,92 0 top
J1  -3,78.5 270 top
J2  40,7 180 top
J3  76.7,32 90 top
JP1  14,65 90 top
JP2  60.75,92.15 180 top
JP3  42,96.5 0 top
JP4  25,43 90 top
JP5  60.9,97.4 180 top
JP6  22.6,63 180 bottom
JP7  22.6,65.5 180 bottom
JP8  25,34 90 top
JP9  22.6,52 180 bottom
JP10  22.6,54.5 180 bottom
JP11  38,43 90 top
JP12  34.6,63 180 bottom
JP13  34.6,65.5 180 bottom
JP14  38,34 90 top
JP15  34.6,52 180 bottom
JP16  34.6,54.5 180 bottom
JP17  51,43 90 top
JP18  46.6,63 180 bottom
JP19  46.6,65.5 180 bottom
JP20  51,34 90 top
JP21  46.6,52 180 bottom
JP22  46.6,54.5 180 bottom
JP23  64,43 90 top
JP24  58.6,63 180 bottom
JP25  58.6,65.5 180 bottom
JP26  64,34 90 top
JP27  58.6,52 180 bottom
JP28  58.6,54.5 180 bottom
JP29  78.9,18.6 0 top
L1  56.01,65.4 180 top
L2  32,65.5 180 top
POWER-EXT  4,65 270 top
RN1  58,96.5 90 top
RN2  49.73,95.33 180 top
RN3  27.4,66.05 180 bottom
RN4  27.4,55.05 180 bottom
RN5  39.4,66.05 180 bottom
RN6  39.4,55.05 180 bottom
RN7  51.4,66.05 180 bottom
RN8  51.4,55.05 180 bottom
RN9  63.4,66.05 180 bottom
RN10  63.4,55.05 180 bottom
T1  77.3,25.5 90 top
U$1  3.5,3.5 0 top
U$2  76.5,3.5 0 top
U$3  14,96.5 0 top
U$4  66,96.5 0 top
U$5  70.8,71.3 0 top

### Tracks (layer width: path | path; a pad name or v marks a point on that pad's centre or on a via)
5V  (via drill 0.8)
  Top 1.27: IC1.4 35.2,79.2 31.5,75.5 31.5,67 | 31.5,67 30,65.5 L2.2 | 31.5,67 v31.5,56.45 C4.1
  Route2 1.905: v31.5,56.45 31.5,38.9 | 31.5,38.9 36.4,38.9 | 36.4,38.9 47.45,38.9 | 47.45,38.9 49.8,38.9 | 49.8,38.9 59.75,38.9 | 59.75,38.9 59.85,38.9 62.68,41.73 JP23.2 | JP26.2 61.87,32.73 59.75,34.85 59.75,38.9 | JP17.2 49.73,38.97 49.8,38.9 | JP11.2 36.73,39.23 36.4,38.9 | JP4.2 23.73,39.22 24.05,38.9 | 24.05,38.9 31.5,38.9 | JP8.2 22.37,32.73 21.6,33.5 21.6,37.25 23.25,38.9 24.05,38.9 | JP14.2 34.37,32.73 31.5,35.6 31.5,38.9 | JP20.2 48.87,32.73 47.45,34.15 47.45,38.9
$2
  Route15 0.61: JP29.2 75.53,21.96 75.39,22.1 T1.2 76.67,26.77 T1.1
A0
  Top 0.254: RN2.7 50.13,94.06 49.08,93 41.69,93 JP3.1 38.6,96.09 36.58,96.09 35.34,97.34 IC3.1
A1
  Top 0.254: RN2.6 49.33,93.83 49,93.5 43.73,93.5 JP3.3 40.73,96.5 36.75,96.5 34.8,98.45 31.58,98.45 31.38,98.25 IC3.2
A2  (via drill 0.35)
  Top 0.254: JP3.5 48.01,95.23 RN2.5
  Top 0.305: v33.6,87.1 32.46,87.1 30.18,89.38 30.18,91.44 IC3.21
  Route2 0.305: v33.6,87.1 40.01,93.5 40.23,93.5 v40.3,93.35
  Bottom 0.254: JP3.5 44.48,95.23 42.6,93.35 v40.3,93.35
DN0
  Bottom 0.305: IC4.3 29.72,60.81 30.63,60.81 32.46,58.98 32.46,31.32 21.03,19.89 J2.A6
DN1  (via drill 0.35)
  Top 0.305: v27.63,34.34 27.12,33.83 25.83,33.83 24.92,32.92 24.92,31.77 19.43,26.29 19.43,25.83 17.14,23.55 J2.E6
  Bottom 0.305: v27.63,34.34 30.86,37.57 30.86,49.38 30.4,49.84 29.72,49.84 IC5.3
DN2
  Bottom 0.305: IC6.3 41.83,60.81 42.52,60.81 44.12,59.21 44.12,29.03 34.98,19.89 J2.B6
DN3  (via drill 0.35)
  Top 0.305: v40.46,34.29 40.46,32.23 35.66,27.43 34.52,27.43 33.6,26.52 33.6,26.06 31.32,23.77 J2.F6
  Bottom 0.305: v40.46,34.29 42.75,36.58 42.75,49.61 42.52,49.84 41.83,49.84 IC7.3
DN4
  Bottom 0.305: IC8.3 53.72,60.81 55.55,60.81 55.78,60.58 55.78,29.26 54.29,27.77 54.29,25.03 48.92,19.66 J2.C6
DN5
  Bottom 0.305: IC9.3 53.72,49.84 54.41,49.84 54.86,49.38 54.86,29.72 53.13,27.98 53.13,25.24 50.52,22.63 46.18,22.63 45.26,23.55 J2.G6
DN6
  Route2 0.61: J2.D6 67.46,24.3 77.23,24.3 T1.3
  Bottom 0.305: IC10.3 65.84,60.81 66.52,60.81 67.67,59.66 67.67,25.6 62.87,20.8 62.87,19.89 J2.D6
DN7
  Bottom 0.305: IC11.3 65.84,49.84 66.52,49.84 66.75,49.61 66.75,26.06 65.84,25.15 64.92,25.15 64.01,26.06 64.01,26.75 63.32,27.43 62.41,27.43 61.49,26.52 61.49,25.83 59.21,23.55 J2.H6
DP0  (via drill 0.35)
  Top 0.305: v25.6,58.75 v28.35,61.49
  Bottom 0.305: v28.35,61.49 29.49,61.49 IC4.2 | v25.6,58.75 24.02,58.75 19.43,54.16 19.43,25.15 18.29,24 18.29,21.03 17.14,19.89 17.14,17.37 J2.A3
DP1
  Bottom 0.305: IC5.2 29.72,50.52 30.4,50.52 31.32,49.61 31.32,31.32 22.63,22.63 21.72,22.63 21.03,23.32 21.03,26.29 J2.E3
DP2
  Bottom 0.305: IC6.2 41.83,61.49 42.52,61.49 44.58,59.44 44.58,28.57 36.12,20.12 36.12,18.52 34.75,17.14 34.75,16.69 33.6,15.54 28.57,15.54 27.43,16.69 27.43,17.6 28.12,18.29 30.18,18.29 31.09,17.37 J2.B3
DP3  (via drill 0.35)
  Top 0.305: v40.69,30 38.92,30 35.43,26.52 34.98,26.52 J2.F3
  Bottom 0.305: v40.69,30 43.2,32.52 43.2,49.84 42.52,50.52 41.83,50.52 IC7.2
DP4  (via drill 0.35)
  Top 0.305: v55.09,60.12 v55.09,61.49
  Bottom 0.305: v55.09,61.49 53.72,61.49 IC8.2 | v55.09,60.12 55.09,49.84 55.32,49.61 55.32,29.49 53.63,27.8 53.63,25.06 49.38,20.8 48.46,20.8 47.55,19.89 47.55,19.43 45.26,17.14 J2.C3
DP5  (via drill 0.35)
  Top 0.305: v52.12,49.84 52.17,49.78 v52.17,46.49
  Bottom 0.305: v52.12,49.84 52.81,50.52 53.49,50.52 IC9.2 | v52.17,46.49 52.17,45.77 50.98,44.58 50.98,28.57 48.92,26.52 J2.G3
DP6  (via drill 0.35)
  Top 0.305: v68.35,33.15 68.35,26.52 62.64,20.8 62.41,20.8 61.49,19.89 61.49,19.43 59.21,17.14 J2.D3
  Route2 0.61: J2.D3 61.61,14.6 74.9,14.6 JP29.1
  Bottom 0.305: v68.35,33.15 68.35,59.66 66.52,61.49 65.84,61.49 IC10.2
DP7
  Bottom 0.305: IC11.2 65.84,50.52 66.52,50.52 67.21,49.84 67.21,25.83 66.06,24.69 64.69,24.69 62.87,26.52 J2.H3
FAN0
  Bottom 0.254: JP7.1 21.45,64.86
  Bottom 0.305: 21.45,64.86 21.45,62.1 24.1,59.45 | IC4.4 28.85,59.45 24.1,59.45 | J2.A1 14.63,17.37 14.63,22.17 16,23.55 16,24.12 17.27,25.39 17.27,26.77 18.8,28.3 18.8,54.22 18.77,54.21 24,59.44 24.1,59.45
FAN0POWER
  Route15 1.905: J2.A4 J2.A5 19.68,15.97 20.6,15.05 24.2,15.05 25.95,16.8 25.95,26 29.15,29.2 29.15,38.85 JP4.1
FAN1
  Bottom 0.305: IC5.4 28.85,48.45 24.92,48.45 | JP10.1 21.45,53.86 21.45,51 24,48.45 24.92,48.45 | 24.92,48.45 24.92,32.23 23.55,30.86 23.55,26.52 J2.E1
FAN1POWER
  Route15 1.905: J2.E4 J2.E5 18.41,27.71 20.2,29.5 24.95,29.5 26.27,30.82 JP8.1
FAN2
  Bottom 0.305: IC6.4 41.48,60.23 40.7,59.45 40.69,59.45 | 40.69,59.45 36.05,59.45 33.45,62.05 33.45,64.86 JP13.1 | J2.B1 28.57,17.14 29.49,17.14 30.63,16 31.55,16 32.46,16.92 32.46,18.29 33.83,19.66 33.83,20.12 36.35,22.63 36.58,22.63 43.66,29.72 43.66,56.46 40.69,59.44 40.69,59.45
FAN2POWER
  Route15 1.905: J2.B4 J2.B5 33.65,15.6 34.55,14.7 38,14.7 40.2,16.9 40.2,27.2 42.4,29.4 42.4,38.6 JP11.1
FAN3
  Bottom 0.305: IC7.4 40.85,48.45 37.95,48.45 | JP16.1 33.45,53.86 33.45,50.7 35.7,48.45 37.95,48.45 | 37.95,48.45 37.95,32.23 37.49,31.77 37.49,26.52 J2.F1
FAN3POWER
  Route15 1.905: J2.F4 J2.F5 32.38,27.53 34.35,29.5 37.85,29.5 39.27,30.92 JP14.1
FAN4
  Bottom 0.305: IC8.4 52.85,59.45 47.65,59.45 45.45,61.65 45.45,64.86 JP19.1 45.95,65.61 45.95,65.84 56.46,76.35 65.61,76.35 69.04,72.92 69.04,26.29 64.24,21.49 64.24,19.43 63.09,18.29 63.09,17.14 61.95,16 44.81,16 43.66,17.14 42.75,17.14 J2.C1
FAN4POWER
  Route15 1.905: J2.C4 J2.C5 47.62,15.93 49.8,13.75 52,13.75 53.95,15.7 53.95,27 55.5,28.55 55.5,38.5 JP17.1
FAN5
  Bottom 0.305: IC9.4 52.95,48.55 | 52.95,48.55 52.85,48.45 47.9,48.45 45.45,50.9 45.45,53.86 JP22.1 | 52.95,48.55 53.49,48.01 53.49,32.23 51.44,30.18 51.44,26.52 J2.G1
FAN5POWER
  Route15 1.905: J2.G4 J2.G5 46.35,28.45 47.1,29.2 51.05,29.2 52.27,30.42 JP20.1
FAN6
  Route2 0.406: J2.D1 56.51,21.06 54.7,22.87 54.7,26.6 58.3,30.2 72,30.2 78.1,36.3 78.1,40.6 J3.3
  Bottom 0.305: IC10.4 64.8,59.4 60.05,59.4 59.04,60.41 | 59.04,60.41 57.45,62 57.45,64.86 JP25.1 | 59.04,60.41 56.46,57.84 56.46,29.26 55.32,28.12 55.32,23.32 56.46,22.17 56.46,17.37 J2.D1
FAN6POWER
  Route15 1.905: J2.D4 J2.D5 61.59,16.31 62.8,15.1 65.23,15.1 66.34,16.21 66.34,17.77 67.99,19.41 70.97,19.41 72.75,21.2 72.75,34.25 | JP23.1 72.75,34.25 | 72.75,34.25 75,32 J3.1
FAN7
  Bottom 0.305: IC11.4 64.85,48.45 64.01,48.45 | JP28.1 57.45,53.86 57.45,50.6 59.6,48.45 64.01,48.45 | 64.01,48.45 64.01,32.46 65.38,31.09 65.38,26.52 J2.H1
FAN7POWER
  Route15 1.905: J2.H4 J2.H5 60.32,28.07 61.3,29.05 64.25,29.05 65.27,30.07 JP26.1
GND  (via drill 0.35, 0.55)
  Top 0.254: RN2.4 RN2.3 RN2.2 | IC1.6 24.2,74.85 v24.2,71.2 | IC1.6 30,74.35 v30,70.9 | IC1.6 26.85,80.15 28.3,81.6 v28.3,83.5 | IC1.6 26.85,81.35 25.35,82.85 v25.35,84.5 | IC2.6 64.4,74.25 v64.4,71.5 | IC2.6 61.15,76.15 58.5,73.5 58.5,72.5 v59.9,71.1 | IC2.6 59.95,76.3 59.95,72.35 60.8,71.5 v60.8,70.8 | v56.7,82.6 60,79.3 60,78.1 | v56.6,80.2 58.5,78.3 59.8,78.3
  Top 0.305: v56.6,81.5 59.8,78.3 60,78.1 60.6,77.5 IC2.6 61.15,73.65 v64.25,70.55
  Top 1.27: 40.8,80.9 IC1.5 30.25,80.9 IC1.6 | 40.8,80.9 D1.2 | IC2.5 47.2,74.1 D8.2 47,75.5 49,77.5 IC2.3 | IC1.3 39,77.5 40.8,79.3 40.8,80.9
  Bottom 0.305: C7.2 26.55,60.65 26.12,60.23 IC4.5 | C8.2 26.55,49.55 26.23,49.23 IC5.5 | C9.2 39.35,63.25 39.35,61.35 38.2,60.2 37.2,60.2 IC6.5 | C10.2 38.55,49.65 38.12,49.23 IC7.5 | C11.2 50.55,60.55 50.23,60.23 IC8.5 | C13.2 63.3,63.3 63.3,61.3 62.2,60.2 61.2,60.2 IC10.5 | C14.2 62.55,52.8 63.3,52.05 63.3,50.1 62.42,49.23 IC11.5 61.04,49.15 | C12.2 50.55,49.6 50.17,49.23 IC9.5
  other vias: 46.95,96.4 55.95,67.6 43.45,81.55 47.05,70.95 42.1,63.1 41.05,70.05 28.65,46.7 40.7,46.9 49.8,46.9 41.95,54.65 59.8,56.85 63.45,60.4 50.9,49.3 26.8,49.3 50.65,60.25 49.8,58.45 66,58.3 64.1,49.6 65.8,48 64.75,46.2 63,46.25 54.35,54.3 54.15,48.35 50.15,25.35 40,49.45 40.15,60.3 42.3,59.05 28.15,60.25 24.3,57.95 68,67.05 22.2,94.2 33.3,94.3 16.2,31.5 52.6,91.2
  pour Bottom: 0,100 0,0 80,0 80,100
  pour Top: 0,100 0,0 80,0 80,100
  pour Route2: 0,100 0,0 80,0 80,100
  pour Route15: 0,100 0,0 80,0 80,100
IDC_VDD
  Top 1.905: JP1.5 15.27,83.78 7.05,92 IDC1.3
  Bottom 1.905: IDC1.3 6.77,92 7.07,91.7 34.3,91.7 38.3,87.7 68.8,87.7 73.1,92 IDC2.3
N$1
  Top 1.27: D1.1 40.5,75.8 IC1.2 34.8,75.8 34,75 34,68.55 L2.1
N$2
  Top 0.254: JP5.2 60.39,97.43 60.12,97.7 RN1.4 57.47,98.86 54.51,98.86 C5.1 53.49,98.86 31.31,98.86 30.73,98.28 IC3.3
N$3
  Bottom 0.254: JP6.2 23.73,63.63 23.73,65.81 25.63,67.71 27.02,67.71 27.8,66.92 RN3.3
N$4
  Top 1.905: POWER-EXT.1 11.04,60.5 14,60.5 15.27,61.77 JP1.1
N$5
  Bottom 0.254: JP7.2 23.28,65.67 23.28,66.08 25.31,68.11 27.39,68.11 28.6,66.9 RN3.4
N$6
  Top 1.905: J1.PWR 11.5,77.7 11.5,72 10,70.5 10,66 11,65 JP1.4
N$7
  Bottom 0.254: JP9.2 23.74,52.64 23.74,54.76 25.67,56.69 27.26,56.69 27.8,56.15 RN4.3
N$8
  Bottom 0.254: JP10.2 23.34,54.73 23.34,54.93 25.5,57.09 27.71,57.09 28.6,56.2 RN4.4
N$9
  Bottom 0.254: JP12.2 35.76,63.66 35.76,65.78 37.67,67.69 39.36,67.69 39.8,67.25 RN5.3
N$10
  Bottom 0.254: JP13.2 35.36,65.75 35.36,65.95 37.5,68.09 39.53,68.09 40.6,67.03 RN5.4
N$11
  Bottom 0.254: JP15.2 35.76,52.66 35.76,54.94 37.53,56.71 39.29,56.71 39.8,56.2 RN6.3
N$12  (via drill 0.8)
  Top 1.905: IDC1.5 7.51,94.54 12.05,90 12.35,90 v12.75,89.6
  Bottom 1.905: v12.75,89.6 33.2,89.6 37.25,85.55 70.02,85.55 73.73,89.26 IDC2.5
N$13
  Bottom 0.254: JP16.2 35.36,54.75 35.36,55.11 37.36,57.11 39.46,57.11 40.6,55.98 RN6.4
N$14
  Bottom 0.254: JP18.2 47.75,63.64 47.75,65.77 49.67,67.69 51.31,67.69 51.8,67.2 RN7.3
N$15
  Bottom 0.254: JP19.2 47.34,65.74 47.34,65.94 49.5,68.09 51.48,68.09 52.6,66.97 RN7.4
N$16
  Bottom 0.254: JP21.2 47.76,52.66 47.76,54.84 49.63,56.71 51.29,56.71 51.8,56.2 RN8.3
N$17
  Bottom 0.254: JP22.2 47.36,54.75 47.36,55.01 49.46,57.11 51.84,57.11 52.6,56.35 RN8.4
N$18
  Bottom 0.254: JP24.2 59.76,63.66 59.76,65.99 61.53,67.76 63.19,67.76 63.8,67.15 RN9.3
N$19
  Bottom 0.254: JP25.2 59.36,65.75 59.36,66.16 61.36,68.16 63.79,68.16 64.6,67.35 RN9.4
N$20
  Top 1.27: D8.1 47.5,79.2 IC2.2 53.8,79.2 55.5,77.5 55.5,70.96 L1.1
N$21
  Bottom 0.254: JP27.2 59.74,52.64 59.74,54.92 61.53,56.71 63.24,56.71 63.8,56.15 RN10.3
N$22
  Bottom 0.254: JP28.2 59.34,54.73 59.34,55.09 61.36,57.11 63.79,57.11 64.6,56.3 RN10.4
N$25
  Top 0.254: RN1.2 58.67,96.05 58.9,96.05 59.48,95.47 JP2.3
N$26
  Top 0.254: JP2.1 62.02,94.23 59.35,96.9 RN1.3
RST
  Top 0.305: JP5.1 61.41,95.79 64.6,92.6 67.9,92.6 72.5,97.2 76.05,97.2 77.85,95.4 77.85,93.76 77.39,93.3 75.75,93.3 75.03,92.58 75.03,90.7 IDC2.6
  Bottom 0.305: IDC1.6 3.66,94.41 3.66,93.73 2.29,92.35 2.29,88.22 4.1,86.41 33.87,86.41 36.54,83.74 70.48,83.74 76.12,89.38 IDC2.6
SCL  (via drill 0.35)
  Top 0.406: IDC2.1 73.34,94.54 68.47,89.67 60.69,89.67 JP2.4 59.48,90.83 58.39,89.74 32.6,89.74 | IC3.22 30.73,90.48 31.47,89.74 32.6,89.74 | v32.6,88.02 32.6,89.74
  Bottom 0.406: IDC1.1 7.56,88.17 32.45,88.17 v32.6,88.02
SCL0  (via drill 0.35)
  Top 0.305: v29.03,93.5 29.49,93.95 29.49,97.16 IC3.5 | v23.55,85.62 23.55,83.44 23.09,82.98 23.09,66.06 24.69,64.47 v24.82,64.25
  Route2 0.305: v29.03,93.5 29.03,93.27 24,88.24 23.77,88.24 23.55,88.01 v23.55,85.62
  Bottom 0.254: RN3.1 26.18,66.67 24.82,65.32 v24.82,64.25 25.18,63.89 IC4.8
SCL1  (via drill 0.35)
  Top 0.305: v28.12,96.01 28.12,97.16 IC3.7 | v21.03,87.4 21.03,53.95 23.77,51.21 24.46,51.21 25.38,52.12 v25.18,52.15
  Route2 0.305: v28.12,96.01 27.2,95.1 26.52,95.1 25.38,93.95 25.38,92.35 21.03,88.01 v21.03,87.4
  Bottom 0.254: IC5.8 v25.18,52.15 25.18,54.65 RN4.1
SCL2  (via drill 0.35)
  Top 0.305: v26.75,96.01 26.75,97.16 IC3.9
  Route15 0.305: v26.75,96.01 27.89,94.87 29.95,94.87 30.86,93.95 30.86,69.49 38.18,62.18 38.41,62.18 v38.45,62.2
  Bottom 0.254: RN5.1 37.17,65.65 IC6.8 38.42,62.17 v38.45,62.2
SCL3  (via drill 0.35)
  Top 0.305: v18.27,94.64 22.16,98.53 25.15,98.53 25.6,98.07 25.6,97.38 IC3.11 | v20.34,61.72 20.34,53.95 23.55,50.75 36.59,50.75 37.33,51.49 37.33,52.25 v37.38,52.25
  Bottom 0.254: IC7.8 37.38,51.38 v37.38,52.25 37.38,54.85 RN6.1
  Bottom 0.305: v18.27,94.64 18.27,94.58 16.74,93.05 9.59,93.05 6.63,96.01 3.43,96.01 1.83,94.41 1.83,85.04 8.23,78.64 8.23,76.81 20.34,64.69 v20.34,61.72
SCL4  (via drill 0.35)
  Top 0.305: v32.92,82.07 32.02,82.07 25.6,88.48 25.6,91.44 IC3.14 | v45.72,69.27 48.69,66.29 48.69,64.03 v48.83,63.95
  Bottom 0.254: RN7.1 48.83,65.3 v48.83,63.95 48.83,62.52 IC8.8
  Bottom 0.305: v45.72,69.27 v32.92,82.07
SCL5  (via drill 0.35)
  Top 0.305: IC3.16 26.82,88.78 32.2,83.4 64.5,83.4 65.4,82.5 65.4,67.95 68.45,64.9 68.45,53.05 66.63,51.23 50.09,51.23 v49.17,52.15
  Bottom 0.254: IC9.8 v49.17,52.15 49.17,54.65 RN8.1
SCL6  (via drill 0.35)
  Top 0.305: v65.61,65.25 62.55,62.19 v62.5,62.2 | IC3.18 28.12,91.44 28.12,88.92 32.58,84.47 65.52,84.47 66.92,83.07 v66.92,73.94
  Bottom 0.254: RN9.1 61.17,65.65 IC10.8 61.2,62.2 v62.5,62.2
  Bottom 0.305: v66.92,73.94 66.92,66.56 v65.61,65.25
SCL7  (via drill 0.35)
  Top 0.305: v33.15,85.72 29.49,89.38 29.49,91.44 IC3.20 | v56.69,77.5 56.69,72.01 60.35,68.35 63.55,68.35 67.34,64.56 67.34,53.39 66.15,52.2 61.93,52.2 v61.17,52.95
  Bottom 0.254: IC11.8 v61.17,52.95 61.17,54.65 RN10.1
  Bottom 0.305: v33.15,85.72 33.15,85.7 41.35,77.5 v56.69,77.5
SDA
  Top 0.406: IDC2.2 76.27,94.93 74.95,96.25 72.85,96.25 67.48,90.88 JP2.2 61.12,90.88 60,92 58.85,92 57.15,90.3 31.7,90.3 31.38,90.62 IC3.23 31.36,91.48 31.36,92.35 31,92.7 24.6,92.7 11.6,92.7 8.2,96.1 3.4,96.1 2.2,94.9 2.2,90.99 IDC1.2
SDA0  (via drill 0.35)
  Top 0.305: v30.18,93.5 30.18,97.16 IC3.4 | v24.25,87.43 24.23,87.45 22.63,85.85 22.63,64.47 24,63.09 v24.14,63
  Route2 0.305: v30.18,93.5 30.18,93.4 24.38,87.6 24.2,87.48 v24.25,87.43
  Bottom 0.254: IC4.7 24.36,61.52 24.14,61.74 v24.14,63 24.14,65.59 25.85,67.3 26.6,67.3 27,66.9 RN3.2
SDA1  (via drill 0.35)
  Top 0.305: v28.35,94.18 28.8,94.64 28.8,97.16 IC3.6 | v22.4,87.4 22.4,86.41 22.17,86.18 22.17,53.95 24,52.12 v24.15,51.9
  Route2 0.305: v28.35,94.18 28.35,93.27 23.77,88.7 23.55,88.7 22.4,87.55 v22.4,87.4
  Bottom 0.254: IC5.7 24.43,50.52 24.15,50.8 v24.15,51.9 24.15,54.59 25.83,56.28 26.57,56.28 27,55.84 RN4.2
SDA2  (via drill 0.35)
  Top 0.305: v27.43,93.5 27.43,97.16 IC3.8
  Route15 0.305: v27.43,93.5 27.43,70.87 36.12,62.18 v35.92,62.11
  Bottom 0.254: IC6.7 36.38,61.52 36.17,61.73 36.17,62.36 | 36.17,62.36 36.17,65.62 37.83,67.28 38.87,67.28 39,67.15 RN5.2 | 36.17,62.36 v35.92,62.11
SDA3  (via drill 0.35)
  Top 0.305: v26.06,93.5 26.06,97.16 IC3.10 | v32.69,74.98 32.69,54.63 35.2,52.12 36.12,52.12 v36.17,52
  Route2 0.305: v26.06,93.5 26.06,92.35 21.72,88.01 21.72,85.95 v32.69,74.98
  Bottom 0.254: IC7.7 36.42,50.52 36.17,50.78 v36.17,52 | 36.17,52.05 36.17,54.77 37.7,56.3 38.8,56.3 39,56.1 RN6.2
  Bottom 0.305: 36.17,52.05 v36.17,52
SDA4  (via drill 0.35)
  Top 0.305: v28.17,84.92 24.92,88.17 24.92,91.44 IC3.13 | v45.72,68.12 45.72,65.38 47.72,63.38 v48.17,62.85
  Bottom 0.254: IC8.7 48.38,61.52 48.17,61.73 v48.17,62.85 48.17,65.62 49.83,67.28 50.72,67.28 51,67 RN7.2
  Bottom 0.305: v45.72,68.12 44.97,68.12 v28.17,84.92
SDA5  (via drill 0.35)
  Top 0.305: v48.17,52 48.17,52.4 48.67,52.9 49.68,52.9 50.84,51.73 66.37,51.73 67.9,53.26 67.9,64.69 63.78,68.81 60.58,68.81 57.38,72.01 57.38,77.95 52.58,82.75 32.07,82.75 26.19,88.63 IC3.15
  Bottom 0.254: IC9.7 48.33,50.52 48.17,50.68 v48.17,52 48.17,54.67 49.8,56.3 50.7,56.3 51,56 RN8.2
SDA6  (via drill 0.35)
  Top 0.305: v66.2,74.67 66,74.87 66,82.85 64.84,84.01 32.35,84.01 27.43,88.92 27.43,91.44 IC3.17 | v57.84,66.75 57.84,64.01 59.89,61.95 v59.92,61.9
  Bottom 0.254: IC10.7 60.33,61.52 60.17,61.68 60.17,62.2 | 60.17,62.2 60.17,65.82 61.7,67.35 62.6,67.35 63,66.95 RN9.2 | 60.17,62.2 59.92,61.95 v59.92,61.9
  Bottom 0.305: v66.2,74.67 65.75,74.67 v57.84,66.75
SDA7  (via drill 0.35)
  Top 0.305: v62.54,50.55 66.67,50.55 68.96,52.84 68.96,82.37 66.4,84.92 32.8,84.92 28.8,88.92 28.8,91.44 IC3.19
  Bottom 0.254: IC11.7 60.38,50.52 60.15,50.75 60.15,54.75 61.7,56.3 62.65,56.3 62.95,56 62.95,55.73 RN10.2
  Bottom 0.305: IC11.7 62.12,50.52 v62.54,50.55
TACH0  (via drill 0.35)
  Top 0.305: v22.86,59.44 22.86,59.89 v23.77,60.81
  Bottom 0.305: JP6.1 22.09,62.21 23.43,60.88 23.77,60.88 | 23.77,60.88 IC4.6 | v22.86,59.44 13.49,50.06 13.49,16.23 13.72,16 15.32,16 15.77,16.46 15.77,19.66 J2.A2 | v23.77,60.81 23.77,60.88
TACH1  (via drill 0.35)
  Top 0.305: v22.4,42.52 22.4,48.46 v23.77,49.84
  Bottom 0.305: IC5.6 23.77,49.88 | 23.77,49.88 23.32,49.88 22.09,51.11 JP9.1 | v22.4,42.52 22.4,23.77 J2.E2 | v23.77,49.84 23.77,49.88
TACH2  (via drill 0.35)
  Top 0.305: v34.75,58.09 34.75,59.89 v35.66,60.81
  Bottom 0.305: IC6.6 35.66,60.88 | 35.66,60.88 35.48,60.88 34.09,62.26 JP12.1 | v34.75,58.09 32.92,56.26 32.92,31.09 31.32,29.49 31.32,26.29 29.95,24.92 29.95,19.89 J2.B2 | v35.66,60.81 35.66,60.88
TACH3  (via drill 0.35)
  Top 0.305: v35.66,49.61 v35.66,42.98
  Bottom 0.305: IC7.6 35.66,49.88 | 35.66,49.88 35.17,49.88 34.09,50.96 JP15.1 | v35.66,42.98 35.66,32.23 36.12,31.77 36.12,23.77 J2.F2 | 35.66,49.88 v35.66,49.61
TACH4  (via drill 0.35)
  Top 0.305: v47.09,43.2 47.09,60.58 v47.32,60.81
  Bottom 0.254: IC8.6 47.32,60.88 46.92,60.88 46.09,61.71 JP18.1
  Bottom 0.305: v47.09,43.2 45.26,41.38 45.26,26.29 43.89,24.92 43.89,19.89 J2.C2 | v47.32,60.81 47.32,60.88
TACH5  (via drill 0.35)
  Top 0.305: v47.78,49.61 v47.78,40.46
  Bottom 0.305: IC9.6 47.78,49.88 | 47.78,49.88 47.12,49.88 46.09,50.91 JP21.1 | v47.78,40.46 47.78,25.83 48.46,25.15 48.69,25.15 50.06,23.77 J2.G2 | 47.78,49.88 v47.78,49.61
TACH6  (via drill 0.35)
  Top 0.305: v57.61,57.84 57.61,58.75 v59.66,60.81
  Route2 0.406: J2.D2 57.78,20.72 55.32,23.18 55.32,26.32 58.6,29.6 72.2,29.6 78.7,36.1 78.7,45 J3.4
  Bottom 0.254: IC10.6 59.66,60.88 59.23,60.88 58.09,62.01 JP24.1
  Bottom 0.305: v57.61,57.84 56.92,57.15 56.92,29.03 56.69,28.8 56.69,25.83 57.61,24.92 57.61,19.89 J2.D2 | v59.66,60.81 59.66,60.88
TACH7  (via drill 0.35)
  Top 0.305: v59.89,49.84 62.41,49.84 69.27,42.98 69.27,35.2 64.24,30.18 64.24,23.77 J2.H2
  Bottom 0.305: IC11.6 59.89,49.88 | 59.89,49.88 58.88,49.88 58.09,50.66 JP27.1 | v59.89,49.84 59.89,49.88
VCC  (via drill 0.35)
  Top 0.254: RN1.5 RN1.6 | RN1.6 RN1.7 | RN1.6 56.05,96.9 55.45,97.5 53,97.5 52.73,97.77 JP3.6
  Top 0.305: v53.26,63.09 53.5,63.09 | 58.58,54.42 C2.1
  Top 0.406: IC3.24 48.56,91.46 v48.7,91.6 49.9,91.6 51.9,93.6 C6.1 54.8,93.6 56.05,94.86 56.05,96.9 | v29.46,63.29 29.36,63.19 29.36,56.56 v29.26,56.46 | 58.58,54.42 64.24,54.42 | 64.24,54.42 v65.43,54.42 | 64.24,54.42 v64.24,61.72
  Top 0.508: v54.41,57.38 54.99,57.96
  Top 1.27: IC2.4 53.2,75.8 v53.5,75.5 53.5,67.94 | 53.5,67.94 L1.2 | 53.5,67.94 53.5,63.09 53.5,59.45 54.99,57.96 C2.1
  Route2 0.61: v53.5,75.5 53.5,86.8 v48.7,91.6
  Bottom 0.254: JP3.6 JP3.4 JP3.2
  Bottom 0.305: RN3.8 RN3.7 RN3.6 RN3.5 28.8,65.61 | 28.6,64.4 C7.1 | RN4.8 RN4.7 RN4.6 RN4.5 28.8,54.63 | 28.6,53.4 C8.1 | RN5.8 RN5.7 RN5.6 RN5.5 40.69,65.61 | 40.6,64.4 C9.1 | RN6.8 RN6.7 RN6.6 RN6.5 | RN6.5 40.6,53.4 C10.1 40.25,52.55 IC7.1 | RN7.8 RN7.7 RN7.6 RN7.5 52.6,64.4 C11.1 52.25,63.55 | RN9.8 RN9.7 RN9.6 RN9.5 64.6,64.4 C13.1 64.25,63.55 | RN10.8 RN10.7 RN10.6 RN10.5 v65.43,54.42 | 64.6,53.4 C14.1 64.25,52.55 | RN8.8 RN8.7 RN8.6 RN8.5 52.81,54.63 | 52.6,53.4 C12.1 52.25,52.55 | 38.51,58.88 41.38,56.01 41.38,55.32 40.69,54.63 RN6.5 | 29.72,62.18 IC4.1 | 41.83,62.18 IC6.1
  Bottom 0.406: RN3.5 28.6,64.4 | C7.1 28.25,63.55 28.98,62.82 | 28.98,62.82 IC4.1 | RN4.5 28.6,53.4 | C8.1 28.25,52.55 IC5.1 | RN5.5 40.6,64.4 | C9.1 40.25,63.55 IC6.1 | 52.25,63.55 52.98,62.81 | 52.98,62.81 IC8.1 | 64.25,63.55 65.16,62.64 | 65.16,62.64 IC10.1 | RN10.5 64.6,53.4 | 64.25,52.55 IC11.1 | RN8.5 52.6,53.4 | 52.25,52.55 IC9.1 | 28.8,54.63 29.26,55.09 v29.26,56.46 | 28.98,62.82 v29.46,63.29 | 38.51,58.88 33.9,58.88 30.6,62.18 29.72,62.18 | v53.26,63.09 52.98,62.81 | 41.83,62.18 44.12,62.18 48.69,57.61 52.12,57.61 53.26,56.46 53.26,56.24 | 53.26,56.24 53.26,55.09 52.81,54.63 | 53.26,56.24 v54.41,57.38 | v64.24,61.72 65.16,62.64 | 28.8,65.61 32.69,65.61 35.66,68.58 39.78,68.58 41.38,66.98 41.38,66.29 40.69,65.61
VDD
  Top 1.27: IC2.1 45.65,80.9 44.2,79.45 44.2,73.9 44,74.1 IC1.1
  Top 1.905: C3.1 15.05,42.95 | 15.05,42.95 C1.1 17.8,54.75 17.8,63.45 16.25,65 JP1.3 | 15.05,42.95 19.15,38.85 26.1,38.85 | 26.1,38.85 28.5,38.85 | 28.5,38.85 39.25,38.85 | 39.25,38.85 41.9,38.85 | 41.9,38.85 44.2,38.85 | 44.2,38.85 52.15,38.85 | 52.15,38.85 54.85,38.85 | 54.85,38.85 65.05,38.85 | 65.05,38.85 66.4,38.85 67.85,40.3 67.85,42.55 66.13,44.27 JP23.3 | JP26.3 65.27,38.63 65.05,38.85 | 54.85,38.85 54.85,42.55 53.13,44.27 JP17.3 | JP20.3 52.27,38.73 52.15,38.85 | JP14.3 39.27,38.83 39.25,38.85 | JP8.3 26.27,38.68 26.1,38.85 | 28.5,38.85 28.5,42.95 27.18,44.27 JP4.3 | JP11.3 40.33,44.27 41.9,42.7 41.9,38.85 | 44.2,38.85 44.2,73.9

### Text on the board
tPlace: A0 | A1 | A2 | i2c Address | i2c Pull-UP | VDD | IDC | 2.1mm | EXT | Power Select | GND | TACH | vdd | vdd | vdd | vdd | FAN | FAN1 | FAN3 | FAN5 | FAN7 | 5V | 5V | 5V | 5V | GND | vdd | vdd | vdd | vdd | VDD | FAN2 | FAN4 | FAN6 | FAN8 | 5V | 5V | 5V | 5V | Austin's Creations | Rack Fan Controller | V0.0.0 | 2N3904 | Fan 7 PCB / Temp Enable